# Altium project Weather_Station_ETH.PRJPCB (part 1 of 2)
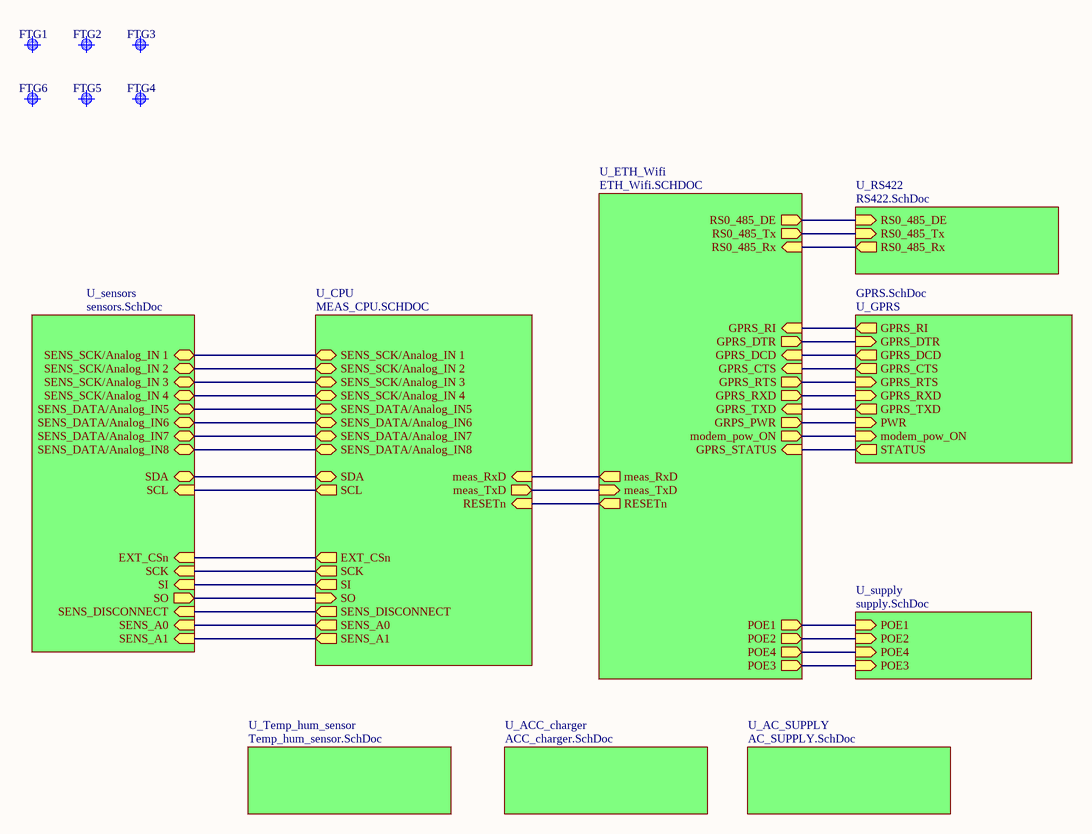
[diagram p0: Weather_Station_ETH.SCHDOC]
10 sheets, 510 parts. Net scope: hierarchical (ports join the sheet entries above them; power ports are global).
Board file: Weather_Station_ETH_HERMETIC.PcbDoc
Sheets:
  Weather_Station_ETH.SCHDOC
    U_ETH_Wifi = ETH_Wifi.SCHDOC
    U_sensors = sensors.SchDoc
    U_supply = supply.SchDoc
    U_CPU = MEAS_CPU.SchDoc
    U_AC_SUPPLY = AC_SUPPLY.SchDoc
    U_GPRS = GPRS.SchDoc
    U_RS422 = RS422.SchDoc
    U_Temp_hum_sensor = Temp_hum_sensor.SchDoc
    U_ACC_charger = ACC_charger.SchDoc

## Sheet Weather_Station_ETH.SCHDOC
size A4; SheetNumber: 0; SheetTotal: 0

### Parts
FTG1  Use only in PCB  [FIDUCIAL_TOP_S100-200]  (value not drawn)
FTG2  Use only in PCB  [FIDUCIAL_TOP_S100-200]  (value not drawn)
FTG3  Use only in PCB  [FIDUCIAL_TOP_S100-200]  (value not drawn)
FTG4  Use only in PCB  [FIDUCIAL_TOP_S100-200]  (value not drawn)
FTG5  Use only in PCB  [FIDUCIAL_TOP_S100-200]  (value not drawn)
FTG6  Use only in PCB  [FIDUCIAL_TOP_S100-200]  (value not drawn)

### Sub-sheets
U_AC_SUPPLY = AC_SUPPLY.SchDoc: no entries
U_ACC_charger = ACC_charger.SchDoc: no entries
U_CPU = MEAS_CPU.SCHDOC: EXT_CSn (out), SI (out), SO (in), SCK (out), SDA (bidir), SCL (out), SENS_A0 (out), SENS_A1 (out), SENS_SCK/Analog_IN 1 (bidir), SENS_SCK/Analog_IN 2 (bidir), SENS_SCK/Analog_IN 3 (bidir), SENS_SCK/Analog_IN 4 (bidir), SENS_DATA/Analog_IN5 (bidir), SENS_DATA/Analog_IN6 (bidir), SENS_DATA/Analog_IN7 (bidir), SENS_DATA/Analog_IN8 (bidir), meas_RxD (in), meas_TxD (out), RESETn (in), SENS_DISCONNECT (out)
U_ETH_Wifi = ETH_Wifi.SCHDOC: POE1 (out), POE2 (out), POE4 (out), POE3 (out), meas_RxD (out), meas_TxD (in), RESETn (out), GPRS_RI (in), GPRS_DTR (out), GPRS_DCD (in), GPRS_CTS (in), GPRS_RTS (out), GPRS_RXD (out), GPRS_TXD (in), GRPS_PWR (out), modem_pow_ON (out), GPRS_STATUS (in), RS0_485_DE (out), RS0_485_Tx (out), RS0_485_Rx (in)
U_GPRS = GPRS.SchDoc: GPRS_DCD (out), GPRS_TXD (out), GPRS_DTR (in), GPRS_RI (out), GPRS_RTS (in), GPRS_RXD (in), GPRS_CTS (out), STATUS (out), PWR (in), modem_pow_ON (in)
U_RS422 = RS422.SchDoc: RS0_485_DE (in), RS0_485_Rx (out), RS0_485_Tx (in)
U_sensors = sensors.SchDoc: SDA (bidir), SCL (in), EXT_CSn (in), SCK (in), SI (in), SO (out), SENS_A0 (in), SENS_A1 (in), SENS_DATA/Analog_IN8 (bidir), SENS_DATA/Analog_IN7 (bidir), SENS_DATA/Analog_IN6 (bidir), SENS_DATA/Analog_IN5 (bidir), SENS_SCK/Analog_IN 4 (bidir), SENS_SCK/Analog_IN 3 (bidir), SENS_SCK/Analog_IN 2 (bidir), SENS_SCK/Analog_IN 1 (bidir), SENS_DISCONNECT (in)
U_supply = supply.SchDoc: POE1 (in), POE2 (in), POE4 (in), POE3 (in)
U_Temp_hum_sensor = Temp_hum_sensor.SchDoc: no entries

### Nets
ADC0_in: sheet U_sensors/SENS_SCK/Analog_IN 1, sheet U_CPU/SENS_SCK/Analog_IN 1
ADC1_in: sheet U_sensors/SENS_SCK/Analog_IN 2, sheet U_CPU/SENS_SCK/Analog_IN 2
ADC2_in: sheet U_sensors/SENS_SCK/Analog_IN 3, sheet U_CPU/SENS_SCK/Analog_IN 3
ADC3_in: sheet U_sensors/SENS_SCK/Analog_IN 4, sheet U_CPU/SENS_SCK/Analog_IN 4
ADC5_in: sheet U_sensors/SENS_DATA/Analog_IN6, sheet U_CPU/SENS_DATA/Analog_IN6
ADC6_in: sheet U_sensors/SENS_DATA/Analog_IN7, sheet U_CPU/SENS_DATA/Analog_IN7
ADC7_in: sheet U_sensors/SENS_DATA/Analog_IN8, sheet U_CPU/SENS_DATA/Analog_IN8
BOOT_SEL: sheet U_sensors/SENS_DISCONNECT, sheet U_CPU/SENS_DISCONNECT
CTS1: sheet U_ETH_Wifi/GPRS_CTS, sheet U_GPRS/GPRS_CTS
modem_pow_ON: sheet U_ETH_Wifi/modem_pow_ON, sheet U_GPRS/modem_pow_ON
RESETn: sheet U_ETH_Wifi/RESETn, sheet U_CPU/RESETn
RS0_485_DE: sheet U_ETH_Wifi/RS0_485_DE, sheet U_RS422/RS0_485_DE
RTS1: sheet U_ETH_Wifi/GPRS_RTS, sheet U_GPRS/GPRS_RTS
RXD2: sheet U_ETH_Wifi/meas_TxD, sheet U_CPU/meas_TxD
SPI_MISO: sheet U_sensors/SO, sheet U_CPU/SO
SPI_MOSI: sheet U_sensors/SI, sheet U_CPU/SI
SPI_SCK: sheet U_sensors/SCK, sheet U_CPU/SCK
STATUS: sheet U_ETH_Wifi/GPRS_STATUS, sheet U_GPRS/STATUS
SWDIO: sheet U_sensors/SENS_DATA/Analog_IN5, sheet U_CPU/SENS_DATA/Analog_IN5
TXD2: sheet U_ETH_Wifi/meas_RxD, sheet U_CPU/meas_RxD
NetIC1_47: sheet U_ETH_Wifi/GPRS_DTR, sheet U_GPRS/GPRS_DTR
NetIC1_48: sheet U_ETH_Wifi/GPRS_DCD, sheet U_GPRS/GPRS_DCD
NetIC1_49: sheet U_ETH_Wifi/GRPS_PWR, sheet U_GPRS/PWR
NetIC1_69: sheet U_ETH_Wifi/GPRS_RI, sheet U_GPRS/GPRS_RI
NetIC6_3: sheet U_sensors/SDA, sheet U_CPU/SDA
NetIC6_9: sheet U_sensors/SENS_A1, sheet U_CPU/SENS_A1
NetIC6_10: sheet U_sensors/SENS_A0, sheet U_CPU/SENS_A0
NetIC6_13: sheet U_sensors/SCL, sheet U_CPU/SCL
NetIC8_13: sheet U_sensors/EXT_CSn, sheet U_CPU/EXT_CSn
NetIC40_1: sheet U_ETH_Wifi/RS0_485_Tx, sheet U_RS422/RS0_485_Tx
NetIC40_2: sheet U_ETH_Wifi/GPRS_RXD, sheet U_GPRS/GPRS_RXD
NetIC40_3: sheet U_ETH_Wifi/RS0_485_Rx, sheet U_RS422/RS0_485_Rx
NetIC40_5: sheet U_ETH_Wifi/GPRS_TXD, sheet U_GPRS/GPRS_TXD
NetJ6_4: sheet U_ETH_Wifi/POE4, sheet U_supply/POE4
NetJ6_5: sheet U_ETH_Wifi/POE3, sheet U_supply/POE3
NetJ6_7: sheet U_ETH_Wifi/POE2, sheet U_supply/POE2
NetJ6_8: sheet U_ETH_Wifi/POE1, sheet U_supply/POE1

### Library data of the parts
FTG1-FTG6 = Fiducial: Fiducial Target; Part Number: FIDUCIAL_TARGET_S100-200; Part Description: Scare Fiducial Target, Top Layer, 1.0mm, Top Sloder 2.0mm, Keepout =2.0mm; Mounted: No; Table: Pads; Component Kind: Standard (No BOM); Component Type: Standard (No BOM); Pin Count: 1; Family: Fiducial; Socket: No; SMD: Yes; Status: None; ComponentHeight: 0mm; Author: CERN DEM JLC; CreateDate: 09.02.2010; LatestRevisionDate: 09.02.2010; PackageDescription: Scare Fiducial Target, Top Layer, 1.0mm, Top Sloder 2.0mm, Keepout =2.0mm

## Sheet ETH_Wifi.SCHDOC
size A3; SheetNumber: 0; SheetTotal: 0
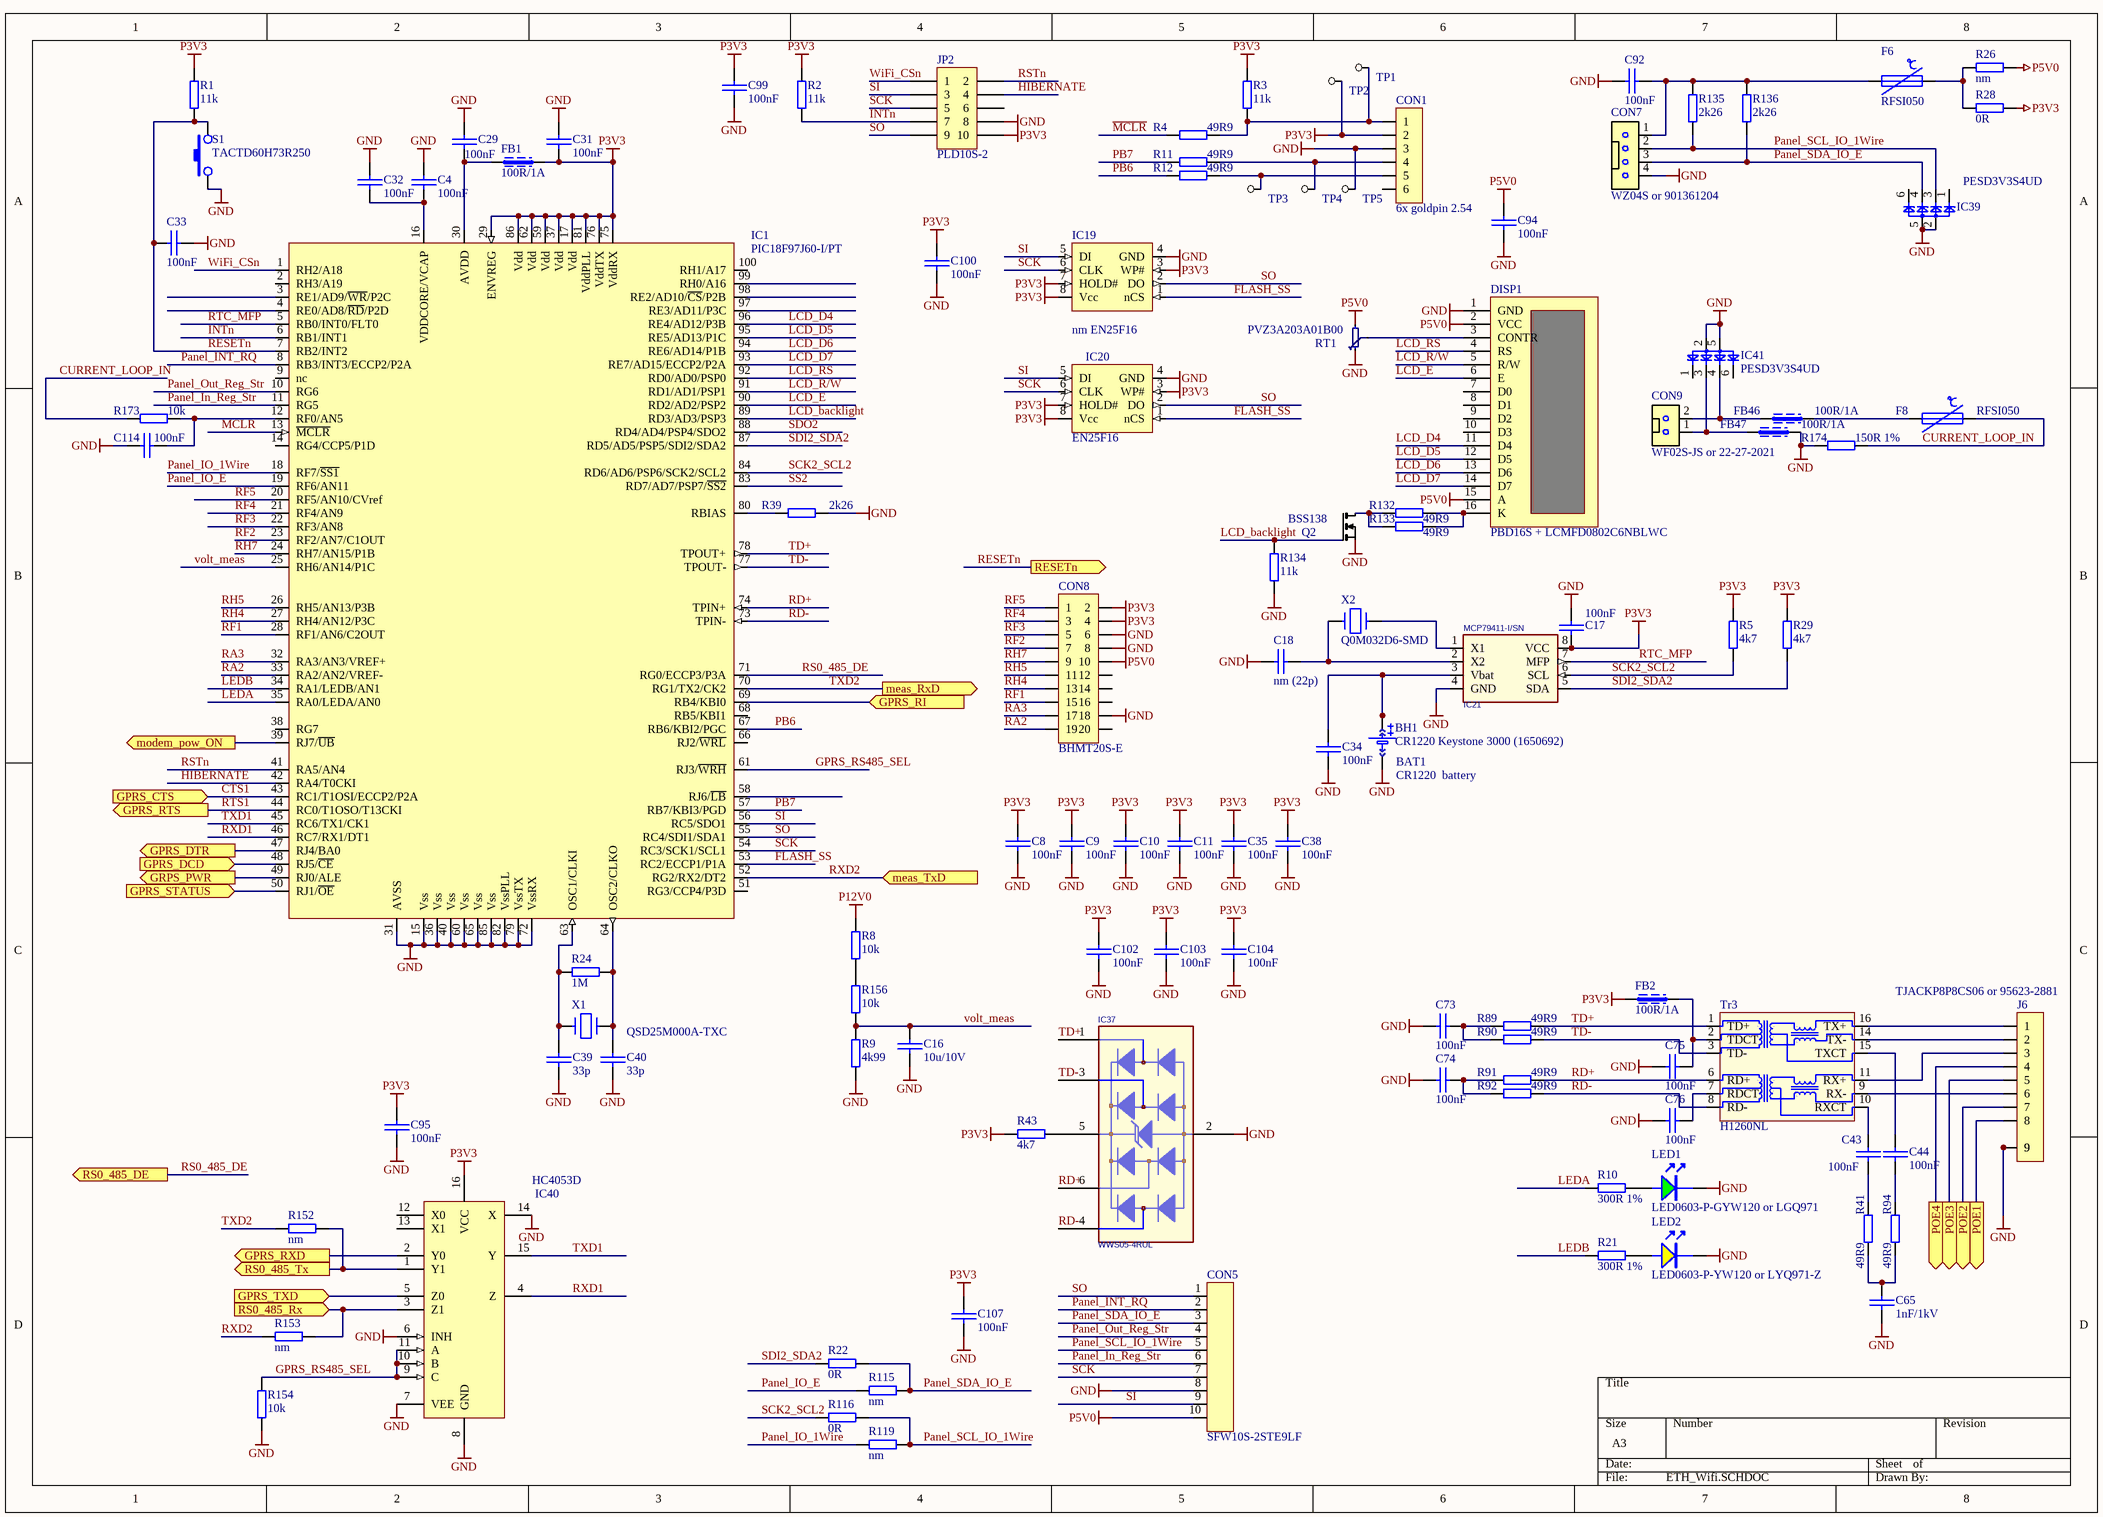
[diagram p1: ETH_Wifi.SCHDOC]

### Parts
BAT1  CR1220  battery  [cr1220]
BH1  CR1220 Keystone 3000 (1650692)  [CR1220_Keystone_3000]
C4  100nF  [0402C]
C8  100nF  [0402C]
C9  100nF  [0402C]
C10  100nF  [0402C]
C11  100nF  [0402C]
C16  10u/10V  [0805C]
C17  100nF  [0402C]
C18  nm (22p)  [0603C]
C29  100nF  [0402C]
C31  100nF  [0402C]
C32  100nF  [0402C]
C33  100nF  [0402C]
C34  100nF  [0402C]
C35  100nF  [0402C]
C38  100nF  [0402C]
C39  33p  [0603C]
C40  33p  [0603C]
C43  100nF  [0402C]
C44  100nF  [0402C]
C65  1nF/1kV  [1206C]
C73  100nF  [0402C]
C74  100nF  [0402C]
C75  100nF  [0402C]
C76  100nF  [0402C]
C92  100nF  [0402C]
C94  100nF  [0402C]
C95  100nF  [0402C]
C99  100nF  [0402C]
C100  100nF  [0402C]
C102  100nF  [0402C]
C103  100nF  [0402C]
C104  100nF  [0402C]
C107  100nF  [0402C]
C114  100nF  [0402C]
CON1  6x goldpin 2.54  [SIP6]
CON5  SFW10S-2STE9LF  [SFW10S-2STE9LF]
CON7  WZ04S or 901361204  [WZ04S]
CON8  BHMT20S-E  [BHMT20S]
CON9  WF02S-JS or 22-27-2021  [CON_WF02S-LF]
DISP1  PBD16S + LCMFD0802C6NBLWC  [LCMFD0802C6NBLWC]
F6  RFSI050  [0805R]
F8  RFSI050  [0805R]
FB1  100R/1A  [0603L]
FB2  100R/1A  [0603L]
FB46  100R/1A  [0603L]
FB47  100R/1A  [0603L]
IC1  PIC18F97J60-I/PT  [lqfp100_12x12mm]
IC19  nm EN25F16  [SO-8L]
IC20  EN25F16  [SO-8]
IC21  MCP79411-I/SN  [SO-8]
IC37  WWS05-4RUL  [SOT23-6]
IC39  PESD3V3S4UD  [SOT457]
IC40  HC4053D  [SO-16]
IC41  PESD3V3S4UD  [SOT457]
J6  TJACKP8P8CS06 or 95623-2881  [ETH_VERT_95623-2881]
JP2  PLD10S-2  [HEADER5X2]
LED1  LED0603-P-GYW120 or LGQ971  [led_0603G]
LED2  LED0603-P-YW120 or LYQ971-Z  [led_0603B]
Q2  BSS138  [SOT-23]
R1  11k  [0603R]
R2  11k  [0603R]
R3  11k  [0603R]
R4  49R9  [0603R]
R5  4k7  [0402R]
R8  10k  [0402R]
R9  4k99  [0603R]
R10  300R 1%  [0603R]
R11  49R9  [0603R]
R12  49R9  [0603R]
R21  300R 1%  [0603R]
R22  0R  [0603R]
R24  1M  [0603R]
R26  nm  [0603R]
R28  0R  [0603R]
R29  4k7  [0402R]
R39  2k26  [0603R]
R41  49R9  [0603]
R43  4k7  [0402R]
R89  49R9  [0603R]
R90  49R9  [0603R]
R91  49R9  [0603R]
R92  49R9  [0603R]
R94  49R9  [0603]
R115  nm  [0603R]
R116  0R  [0603R]
R119  nm  [0603R]
R132  49R9  [0603R]
R133  49R9  [0603R]
R134  11k  [0603R]
R135  2k26  [0603R]
R136  2k26  [0603R]
R152  nm  [0603R]
R153  nm  [0603R]
R154  10k  [0402R]
R156  10k  [0402R]
R173  10k  [0402R]
R174  150R 1%  [0805R]
RT1  PVZ3A203A01B00  [TRIMPOT_PVZ3A]
S1  TACTD60H73R250  [TACT-DQ62H73G160]
TP1  TP_nMCLR  [TP_large]  (value not drawn)
TP2  TP_3V3_ctrl  [TP_large]  (value not drawn)
TP3  TP_PB6  [TP_large]  (value not drawn)
TP4  TP_PB7  [TP_large]  (value not drawn)
TP5  TP_GND_ctrl  [TP_large]  (value not drawn)
Tr3  H1260NL  [H1260NL]
X1  QSD25M000A-TXC  [HC-49SM]
X2  Q0M032D6-SMD  [crystal_85SMX]

### Ports
GPRS_CTS (in), GPRS_DCD (in), GPRS_DTR (out), GPRS_RI (in), GPRS_RTS (out), GPRS_RXD (out), GPRS_STATUS (in), GPRS_TXD (in), GRPS_PWR (out), meas_RxD (out), meas_TxD (in), modem_pow_ON (out), POE1 (out), POE2 (out), POE3 (out), POE4 (out), RESETn (out), RS0_485_DE (out), RS0_485_Rx (in), RS0_485_Tx (out)

### Nets
GND: BH1.neg(+) C4.1 C8.1 C9.2 C10.2 C11.2 C16.2 C17.2 C18.2 C29.1 C31.1 C32.1 C33.2 C34.2 C35.2 C38.2 C39.1 C40.1 C65.2 C73.1 C74.1 C75.1 C76.1 C92.1 C94.1 C95.2 C99.2 C100.2 C102.2 C103.2 C104.2 C107.2 C114.1 CON1.3 CON5.8 CON7.4 CON8.6 CON8.8 CON8.18 DISP1.1(GND) FB47.2 IC1.15(Vss) IC1.31(AVSS) IC1.36(Vss) IC1.40(Vss) IC1.60(Vss) IC1.65(Vss) IC1.72(VssRX) IC1.79(VssTX) IC1.82(VssPLL) IC1.85(Vss) IC19.4(GND) IC20.4(GND) IC21.4(GND) IC37.2 IC39.2 IC39.5 IC40.6(INH) IC40.7(VEE) IC40.8(GND) IC40.14(X) IC41.2 IC41.5 J6.9a(9) J6.9b(9) JP2.8 LED1.K LED2.K Q2.2(S) R9.1 R39.2 R134.1 R154.1 R174.1 RT1.3 S1.1 TP5.1
P3V3: C8.2 C9.1 C10.1 C11.1 C17.1 C31.2 C35.1 C38.1 C95.1 C99.1 C100.1 C102.1 C103.1 C104.1 C107.1 CON1.2 CON8.2 CON8.4 FB1.2 FB2.1 IC1.17(Vdd) IC1.29(ENVREG) IC1.37(Vdd) IC1.59(Vdd) IC1.62(Vdd) IC1.75(VddRX) IC1.76(VddTX) IC1.81(VddPLL) IC1.86(Vdd) IC19.3(WP#) IC19.7(HOLD#) IC19.8(Vcc) IC20.3(WP#) IC20.7(HOLD#) IC20.8(Vcc) IC21.8(VCC) IC40.16(VCC) JP2.10 R1.2 R2.2 R3.2 R5.1 R28.2 R29.1 R43.1 TP2.1
P5V0: C94.2 CON5.10 CON8.10 DISP1.2(VCC) DISP1.15(A) R26.2 RT1.1
P12V0: R8.2
CTS1: IC1.43(RC1/T1OSI/ECCP2/P2A) ; port GPRS_CTS
CURRENT_LOOP_IN: F8.2 R173.1 R174.2
FLASH_SS: IC1.53(RC2/ECCP1/P1A) IC19.1(nCS) IC20.1(nCS)
GPRS_RS485_SEL: IC1.61(RJ3/~{WRH}) IC40.9(C) IC40.10(B) IC40.11(A) R154.2
HIBERNATE: IC1.42(RA4/T0CKI) JP2.4
INTn: IC1.6(RB1/INT1) JP2.7 R2.1
LCD_backlight: IC1.89(RD3/AD3/PSP3) Q2.1(G) R134.2
LCD_D4: DISP1.11(D4) IC1.96(RE4/AD12/P3B)
LCD_D5: DISP1.12(D5) IC1.95(RE5/AD13/P1C)
LCD_D6: DISP1.13(D6) IC1.94(RE6/AD14/P1B)
LCD_D7: DISP1.14(D7) IC1.93(RE7/AD15/ECCP2/P2A)
LCD_E: DISP1.6(E) IC1.90(RD2/AD2/PSP2)
LCD_R/W: DISP1.5(R/W) IC1.91(RD1/AD1/PSP1)
LCD_RS: DISP1.4(RS) IC1.92(RD0/AD0/PSP0)
LEDA: IC1.35(RA0/LEDA/AN0) R10.2
LEDB: IC1.34(RA1/LEDB/AN1) R21.2
~{MCLR}: IC1.13(~{MCLR}) R4.1
modem_pow_ON: IC1.39(RJ7/~{UB}) ; port modem_pow_ON
Panel_In_Reg_Str: CON5.6 IC1.11(RG5)
Panel_INT_RQ: CON5.2 IC1.8(RB3/INT3/ECCP2/P2A)
Panel_IO_1Wire: IC1.18(RF7/~{SS1}) R119.2
Panel_IO_E: IC1.19(RF6/AN11) R115.2
Panel_Out_Reg_Str: CON5.4 IC1.10(RG6)
Panel_SCL_IO_1Wire: CON5.5 CON7.2 IC39.3 R116.1 R119.1 R135.2
Panel_SDA_IO_E: CON5.3 CON7.3 IC39.4 R22.1 R115.1 R136.2
PB6: IC1.67(RB6/KBI2/PGC) R12.1
PB7: IC1.57(RB7/KBI3/PGD) R11.1
RA2: CON8.19 IC1.33(RA2/AN2/VREF-)
RA3: CON8.17 IC1.32(RA3/AN3/VREF+)
RD+: IC1.74(TPIN+) IC37.6 R91.2 Tr3.6(RD+)
RD-: IC1.73(TPIN-) IC37.4 R92.2 Tr3.8(RD-)
RESETn: C33.1 IC1.7(RB2/INT2) R1.1 S1.2 ; port RESETn
RF1: CON8.15 IC1.28(RF1/AN6/C2OUT)
RF2: CON8.7 IC1.23(RF2/AN7/C1OUT)
RF3: CON8.5 IC1.22(RF3/AN8)
RF4: CON8.3 IC1.21(RF4/AN9)
RF5: CON8.1 IC1.20(RF5/AN10/CVref)
RH4: CON8.13 IC1.27(RH4/AN12/P3C)
RH5: CON8.11 IC1.26(RH5/AN13/P3B)
RH7: CON8.9 IC1.24(RH7/AN15/P1B)
RS0_485_DE: IC1.71(RG0/ECCP3/P3A) ; port RS0_485_DE
RSTn: IC1.41(RA5/AN4) JP2.2
RTC_MFP: IC1.5(RB0/INT0/FLT0) IC21.7(MFP)
RTS1: IC1.44(RC0/T1OSO/T13CKI) ; port GPRS_RTS
RXD1: IC1.46(RC7/RX1/DT1) IC40.4(Z)
RXD2: IC1.52(RG2/RX2/DT2) R153.2 ; port meas_TxD
SCK: CON5.7 IC1.54(RC3/SCK1/SCL1) IC19.6(CLK) IC20.6(CLK) JP2.5
SCK2_SCL2: IC1.84(RD6/AD6/PSP6/SCK2/SCL2) IC21.6(SCL) R5.2 R116.2
SDI2_SDA2: IC1.87(RD5/AD5/PSP5/SDI2/SDA2) IC21.5(SDA) R22.2 R29.2
SDO2: IC1.88(RD4/AD4/PSP4/SDO2)
SI: CON5.9 IC1.56(RC5/SDO1) IC19.5(DI) IC20.5(DI) JP2.3
SO: CON5.1 IC1.55(RC4/SDI1/SDA1) IC19.2(DO) IC20.2(DO) JP2.9
SS2: IC1.83(RD7/AD7/PSP7/~{SS2})
STATUS: IC1.50(RJ1/~{OE}) ; port GPRS_STATUS
TD+: IC1.78(TPOUT+) IC37.1 R89.2 Tr3.1(TD+)
TD-: IC1.77(TPOUT-) IC37.3 R90.2 Tr3.3(TD-)
TXD1: IC1.45(RC6/TX1/CK1) IC40.15(Y)
TXD2: IC1.70(RG1/TX2/CK2) R152.2 ; port meas_RxD
volt_meas: C16.1 IC1.25(RH6/AN14/P1C) R9.2 R156.1
WiFi_CSn: IC1.1(RH2/A18) JP2.1
NetBH1_pos1: BH1.pos1(+) BH1.pos2(+) C34.1 IC21.3(Vbat)
NetC4_2: C4.2 C32.2 IC1.16(VDDCORE/VCAP)
NetC18_1: C18.1 IC21.2(X2) X2.4
NetC29_2: C29.2 FB1.1 IC1.30(AVDD)
NetC39_2: C39.2 IC1.63(OSC1/CLKI) R24.1 X1.1
NetC40_2: C40.2 IC1.64(OSC2/CLKO) R24.2 X1.2
NetC43_1: C43.1 R41.2
NetC43_2: C43.2 Tr3.10(RXCT)
NetC44_1: C44.1 R94.2
NetC44_2: C44.2 Tr3.15(TXCT)
NetC65_1: C65.1 R41.1 R94.1
NetC73_2: C73.2 R89.1 R90.1
NetC74_2: C74.2 R91.1 R92.1
NetC75_2: C75.2 FB2.2 Tr3.2(TDCT)
NetC76_2: C76.2 Tr3.7(RDCT)
NetC92_2: C92.2 CON7.1 F6.1 R135.1 R136.1
NetC114_2: C114.2 IC1.12(RF0/AN5) R173.2
NetCON1_1: CON1.1 R3.1 R4.2 TP1.1
NetCON1_4: CON1.4 R11.2 TP4.1
NetCON1_5: CON1.5 R12.2 TP3.1
NetCON9_1: CON9.1 FB47.1 IC41.3
NetCON9_2: CON9.2 FB46.1 IC41.4
NetDISP1_3: DISP1.3(CONTR) RT1.2
NetDISP1_16: DISP1.16(K) R132.2 R133.2
NetF6_2: F6.2 R26.1 R28.1
NetF8_1: F8.1 FB46.2
NetIC1_47: IC1.47(RJ4/BA0) ; port GPRS_DTR
NetIC1_48: IC1.48(RJ5/~{CE}) ; port GPRS_DCD
NetIC1_49: IC1.49(RJ0/ALE) ; port GRPS_PWR
NetIC1_69: IC1.69(RB4/KBI0) ; port GPRS_RI
NetIC1_80: IC1.80(RBIAS) R39.1
NetIC21_1: IC21.1(X1) X2.1
NetIC37_5: IC37.5 R43.2
NetIC40_1: IC40.1(Y1) R152.1 ; port RS0_485_Tx
NetIC40_2: IC40.2(Y0) ; port GPRS_RXD
NetIC40_3: IC40.3(Z1) R153.1 ; port RS0_485_Rx
NetIC40_5: IC40.5(Z0) ; port GPRS_TXD
NetJ6_1: J6.1 Tr3.16(TX+)
NetJ6_2: J6.2 Tr3.14(TX-)
NetJ6_3: J6.3 Tr3.11(RX+)
NetJ6_4: J6.4 ; port POE4
NetJ6_5: J6.5 ; port POE3
NetJ6_6: J6.6 Tr3.9(RX-)
NetJ6_7: J6.7 ; port POE2
NetJ6_8: J6.8 ; port POE1
NetLED1_A: LED1.A R10.1
NetLED2_A: LED2.A R21.1
NetQ2_3: Q2.3(D) R132.1 R133.1
NetR8_1: R8.1 R156.2

Not connected (* = marked no-connect by the designer): CON1 6; CON8 12 14 16 20; DISP1 7(D0) 8(D1) 9(D2) 10(D3); IC1 2(RH3/A19) 3(RE1/AD9/~{WR}/P2C) 4(RE0/AD8/~{RD}/P2D) 9(nc) 14(RG4/CCP5/P1D) 38(RG7) 51(RG3/CCP4/P3D) 58(RJ6/~{LB}) 66(RJ2/~{WRL}) 68(RB5/KBI1) 97(RE3/AD11/P3C) 98(RE2/AD10/~{CS}/P2B) 99(RH0/A16) 100(RH1/A17); IC39 1 6; IC40 12(X0) 13(X1); IC41 1 6; JP2 6

### Library data of the parts
BAT1 = BATTERY_CR1220: CR-21220 Battery 3V 35mAh; Supplier 1: Farnell; Supplier Part Number 1: 1892664
BH1 = BATTERY_HOLD_CR1220: CR-1220 Battery holder; Supplier 1: Newark; Supplier Part Number 1: 66F5622
C4 C8-C11 C17 C29 C31-C35 C38 C43 C44 C73-C76 C92 C94 C95 C99 C100 C102-C104 C107 C114 = CAP_SMD_0402: Capacitor SMD; Supplier 1: Newark; Supplier Part Number 1: 14T3275
C16 = CAP_SMD_0805: Capacitor SMD; Supplier 1: Farnell; Supplier Part Number 1: 1833812
C18 = CAP_SMD_0603: Capacitor SMD
C39 C40 = CAP_SMD: Capacitor SMD
C65 = CAP_SMD_1206: Capacitor SMD; Supplier 1: Newark; Supplier Part Number 1: 90R7810
CON1 = CON6
CON5 = CON_ZIF_10_1mm_SMT_V: FCI ZIF 1mm connector (Farnell)
CON7 = CON_4_2.54_key: 2.54mm crimped terminal header
CON8 = CON_IDC20_SMT_2mm: 20 pin, IDC receptacle, 2mm
CON9 = CON_2_2.54_key: 2.54mm crimped terminal header
DISP1 = LCD_HD44780_LED_2x8: LCD character display socket with backlight
F6 F8 = F_PTC_0.05A: 50mA polymer FUSE
FB1 FB2 FB46 FB47 = L_FERRITE_BEAD: ferrite bead
IC1 = UPC_PIC18F96J65_PT
IC19 IC20 = MEM_EN25F16: FLASH (maritex)
IC21 = RTC_MCP79411: RTC with 1k EEPROM, RAM and 48bit unique ID; Supplier 1: Newark; Supplier Part Number 1: 76R6660
IC37 = D_TVS_WWS05-4RUL: TVS, 5V; Specification: SMD,ESD COMPONENT,ROHS
IC39 IC41 = D_TVS_PESD3V3S4UD: 3.3V TVS
IC40 = 4053
J6 = CON_MOD_8pin_V: Modular 8pin (Maritex or Molex)
JP2 = CON_HEADER 5X2: Goldpin 2.54mm
LED1 = LED_0603G: LED 0603 green; Supplier 1: Newark; Supplier Part Number 1: 05M0493
LED2 = LED_0603Y: LED 0603 yellow; Supplier 1: Newark; Supplier Part Number 1: 56P5112
Q2 = Q_BSS138
R1-R4 R10-R12 R21 R24 R39 R41 R89-R92 R94 R134 = RES_SMD: SMD Resistor
R5 R8 R29 R43 R154 R156 R173 = RES_0402: SMD Resistor; Supplier 1: Newark; Supplier Part Number 1: 59M6691
R9 R22 R26 R28 R115 R116 R119 R132 R133 R135 R136 R152 R153 = RES_0603: SMD Resistor
  R26 R28 R132 R133 R135 R136: Supplier 1: Newark; Supplier Part Number 1: 39K0073
R174 = RES_0805: SMD Resistor; Supplier 1: Newark; Supplier Part Number 1: 05F1507
RT1 = TRIMPOT_SMD_CARBON: carbon SMD trimpot (Farnell)
S1 = SW-PB: Push button 7.3mm
TP1-TP5 = TP: Testpoint
Tr3 = TR_H1260NL: ethernet trafo (TME)
X1 = CRYSTAL: Crystal oscillator
X2 = X_CRYSTAL_32k_SMD: Crystal oscillator 32k (Maritex); Supplier 1: Farnell; Supplier Part Number 1: 1832136

## Sheet sensors.SchDoc
size A4
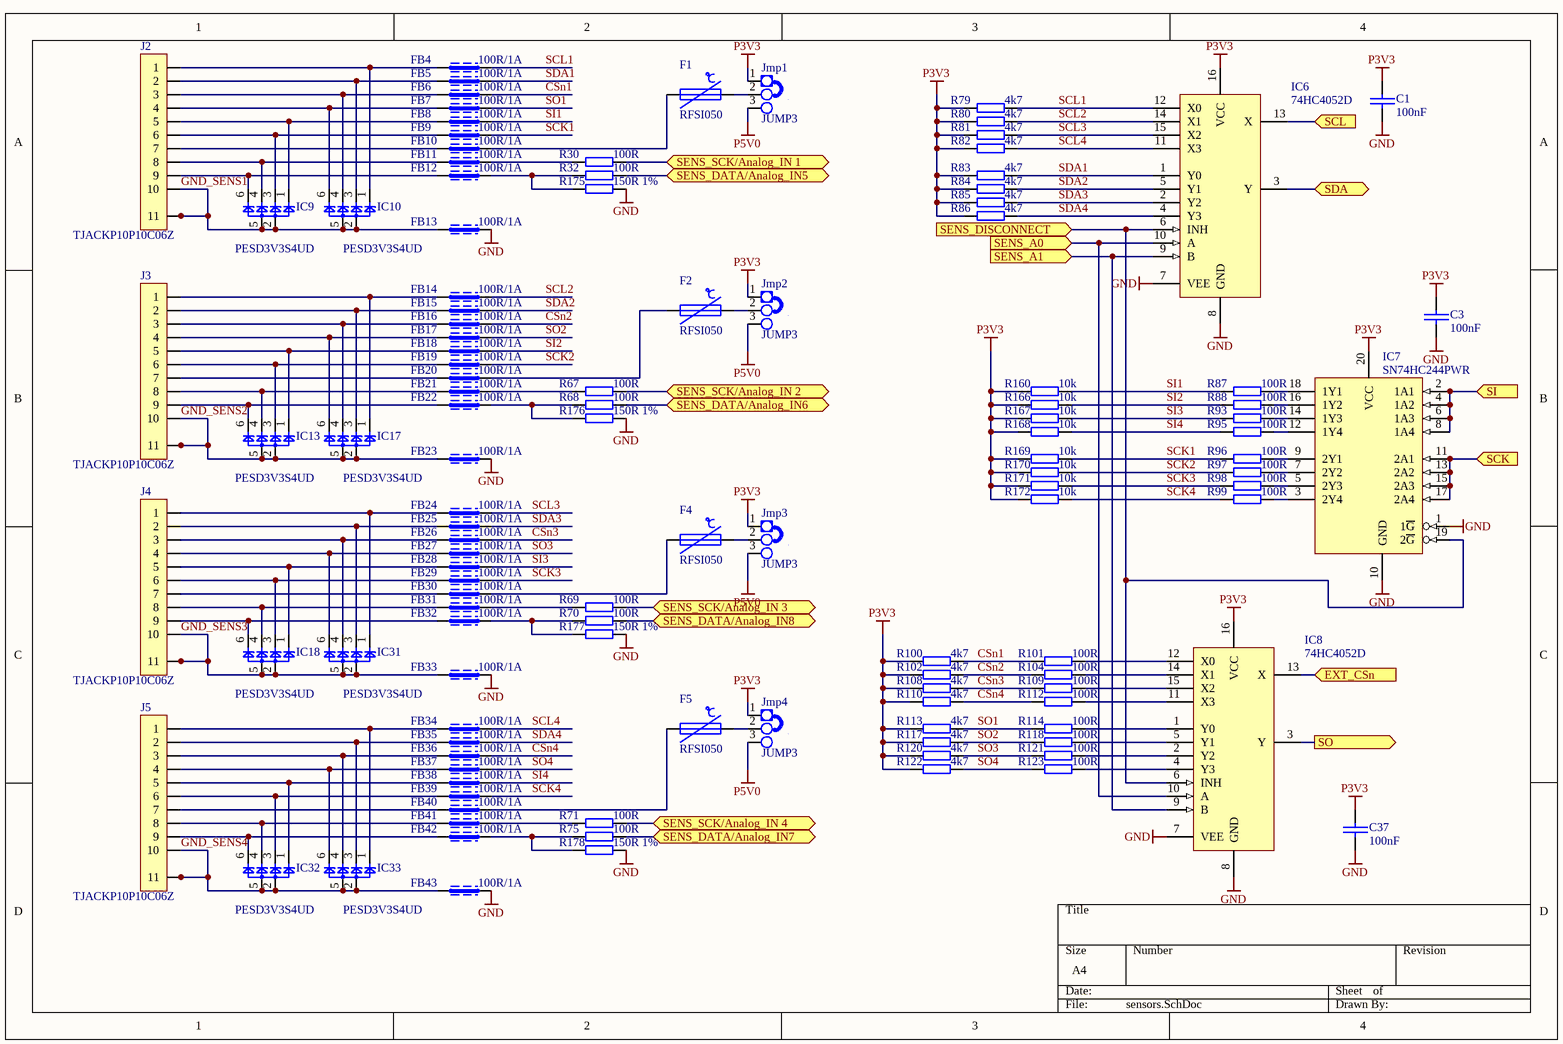
[diagram p2: sensors.SchDoc]

### Parts
C1  100nF  [0402C]
C3  100nF  [0402C]
C37  100nF  [0402C]
F1  RFSI050  [0805R]
F2  RFSI050  [0805R]
F4  RFSI050  [0805R]
F5  RFSI050  [0805R]
FB4  100R/1A  [0603L]
FB5  100R/1A  [0603L]
FB6  100R/1A  [0603L]
FB7  100R/1A  [0603L]
FB8  100R/1A  [0603L]
FB9  100R/1A  [0603L]
FB10  100R/1A  [0603L]
FB11  100R/1A  [0603L]
FB12  100R/1A  [0603L]
FB13  100R/1A  [0603L]
FB14  100R/1A  [0603L]
FB15  100R/1A  [0603L]
FB16  100R/1A  [0603L]
FB17  100R/1A  [0603L]
FB18  100R/1A  [0603L]
FB19  100R/1A  [0603L]
FB20  100R/1A  [0603L]
FB21  100R/1A  [0603L]
FB22  100R/1A  [0603L]
FB23  100R/1A  [0603L]
FB24  100R/1A  [0603L]
FB25  100R/1A  [0603L]
FB26  100R/1A  [0603L]
FB27  100R/1A  [0603L]
FB28  100R/1A  [0603L]
FB29  100R/1A  [0603L]
FB30  100R/1A  [0603L]
FB31  100R/1A  [0603L]
FB32  100R/1A  [0603L]
FB33  100R/1A  [0603L]
FB34  100R/1A  [0603L]
FB35  100R/1A  [0603L]
FB36  100R/1A  [0603L]
FB37  100R/1A  [0603L]
FB38  100R/1A  [0603L]
FB39  100R/1A  [0603L]
FB40  100R/1A  [0603L]
FB41  100R/1A  [0603L]
FB42  100R/1A  [0603L]
FB43  100R/1A  [0603L]
IC6  74HC4052D  [SO-16]
IC7  SN74HC244PWR  [tssop20]
IC8  74HC4052D  [SO-16]
IC9  PESD3V3S4UD  [SOT457]
IC10  PESD3V3S4UD  [SOT457]
IC13  PESD3V3S4UD  [SOT457]
IC17  PESD3V3S4UD  [SOT457]
IC18  PESD3V3S4UD  [SOT457]
IC31  PESD3V3S4UD  [SOT457]
IC32  PESD3V3S4UD  [SOT457]
IC33  PESD3V3S4UD  [SOT457]
J2  TJACKP10P10C06Z  [TJACKP10P10C06Z]
J3  TJACKP10P10C06Z  [TJACKP10P10C06Z]
J4  TJACKP10P10C06Z  [TJACKP10P10C06Z]
J5  TJACKP10P10C06Z  [TJACKP10P10C06Z]
Jmp1  JUMP3  [jump3]
Jmp2  JUMP3  [jump3]
Jmp3  JUMP3  [jump3]
Jmp4  JUMP3  [jump3]
R30  100R  [0402R]
R32  100R  [0402R]
R67  100R  [0402R]
R68  100R  [0402R]
R69  100R  [0402R]
R70  100R  [0402R]
R71  100R  [0402R]
R75  100R  [0402R]
R79  4k7  [0402R]
R80  4k7  [0402R]
R81  4k7  [0402R]
R82  4k7  [0402R]
R83  4k7  [0402R]
R84  4k7  [0402R]
R85  4k7  [0402R]
R86  4k7  [0402R]
R87  100R  [0402R]
R88  100R  [0402R]
R93  100R  [0402R]
R95  100R  [0402R]
R96  100R  [0402R]
R97  100R  [0402R]
R98  100R  [0402R]
R99  100R  [0402R]
R100  4k7  [0402R]
R101  100R  [0402R]
R102  4k7  [0402R]
R104  100R  [0402R]
R108  4k7  [0402R]
R109  100R  [0402R]
R110  4k7  [0402R]
R112  100R  [0402R]
R113  4k7  [0402R]
R114  100R  [0402R]
R117  4k7  [0402R]
R118  100R  [0402R]
R120  4k7  [0402R]
R121  100R  [0402R]
R122  4k7  [0402R]
R123  100R  [0402R]
R160  10k  [0402R]
R166  10k  [0402R]
R167  10k  [0402R]
R168  10k  [0402R]
R169  10k  [0402R]
R170  10k  [0402R]
R171  10k  [0402R]
R172  10k  [0402R]
R175  150R 1%  [0805R]
R176  150R 1%  [0805R]
R177  150R 1%  [0805R]
R178  150R 1%  [0805R]

### Ports
EXT_CSn (in), SCK (in), SCL (in), SDA (bidir), SENS_A0 (in), SENS_A1 (in), SENS_DATA/Analog_IN5 (bidir), SENS_DATA/Analog_IN6 (bidir), SENS_DATA/Analog_IN7 (bidir), SENS_DATA/Analog_IN8 (bidir), SENS_DISCONNECT (in), SENS_SCK/Analog_IN 1 (bidir), SENS_SCK/Analog_IN 2 (bidir), SENS_SCK/Analog_IN 3 (bidir), SENS_SCK/Analog_IN 4 (bidir), SI (in), SO (out)

### Nets
GND: C1.2 C3.2 C37.2 FB13.2 FB23.2 FB33.2 FB43.2 IC6.7(VEE) IC6.8(GND) IC7.1(1~{G}) IC7.10(GND) IC8.7(VEE) IC8.8(GND) R175.2 R176.2 R177.2 R178.2
P3V3: C1.1 C3.1 C37.1 IC6.16(VCC) IC7.20(VCC) IC8.16(VCC) Jmp1.1 Jmp2.1 Jmp3.1 Jmp4.1 R79.1 R80.1 R81.1 R82.1 R83.1 R84.1 R85.1 R86.1 R100.1 R102.1 R108.1 R110.1 R113.1 R117.1 R120.1 R122.1 R160.1 R166.1 R167.1 R168.1 R169.1 R170.1 R171.1 R172.1
P5V0: Jmp1.3 Jmp2.3 Jmp3.3 Jmp4.3
ADC0_in: R30.2 ; port SENS_SCK/Analog_IN 1
ADC1_in: R67.2 ; port SENS_SCK/Analog_IN 2
ADC2_in: R69.2 ; port SENS_SCK/Analog_IN 3
ADC3_in: R71.2 ; port SENS_SCK/Analog_IN 4
ADC5_in: R68.2 ; port SENS_DATA/Analog_IN6
ADC6_in: R75.2 ; port SENS_DATA/Analog_IN7
ADC7_in: R70.2 ; port SENS_DATA/Analog_IN8
BOOT_SEL: IC6.6(INH) IC7.19(2~{G}) IC8.6(INH) ; port SENS_DISCONNECT
CSn1: FB6.2 R100.2 R101.1
CSn2: FB16.2 R102.2 R104.1
CSn3: FB26.2 R108.2 R109.1
CSn4: FB36.2 R110.2 R112.1
GND_SENS1: FB13.1 IC9.2 IC9.5 IC10.2 IC10.5 J2.10 J2.11 J2.11a J2.12 J2.12a
GND_SENS2: FB23.1 IC13.2 IC13.5 IC17.2 IC17.5 J3.10 J3.11 J3.11a J3.12 J3.12a
GND_SENS3: FB33.1 IC18.2 IC18.5 IC31.2 IC31.5 J4.10 J4.11 J4.11a J4.12 J4.12a
GND_SENS4: FB43.1 IC32.2 IC32.5 IC33.2 IC33.5 J5.10 J5.11 J5.11a J5.12 J5.12a
SCK1: FB9.2 R96.1 R169.2
SCK2: FB19.2 R97.1 R170.2
SCK3: FB29.2 R98.1 R171.2
SCK4: FB39.2 R99.1 R172.2
SCL1: FB4.2 IC6.12(X0) R79.2
SCL2: FB14.2 IC6.14(X1) R80.2
SCL3: FB24.2 IC6.15(X2) R81.2
SCL4: FB34.2 IC6.11(X3) R82.2
SDA1: FB5.2 IC6.1(Y0) R83.2
SDA2: FB15.2 IC6.5(Y1) R84.2
SDA3: FB25.2 IC6.2(Y2) R85.2
SDA4: FB35.2 IC6.4(Y3) R86.2
SI1: FB8.2 R87.1 R160.2
SI2: FB18.2 R88.1 R166.2
SI3: FB28.2 R93.1 R167.2
SI4: FB38.2 R95.1 R168.2
SO1: FB7.2 R113.2 R114.1
SO2: FB17.2 R117.2 R118.1
SO3: FB27.2 R120.2 R121.1
SO4: FB37.2 R122.2 R123.1
SPI_MISO: IC8.3(Y) ; port SO
SPI_MOSI: IC7.2(1A1) IC7.4(1A2) IC7.6(1A3) IC7.8(1A4) ; port SI
SPI_SCK: IC7.11(2A1) IC7.13(2A2) IC7.15(2A3) IC7.17(2A4) ; port SCK
SWDIO: R32.2 ; port SENS_DATA/Analog_IN5
NetF1_1: F1.1 FB10.2
NetF1_2: F1.2 Jmp1.2
NetF2_1: F2.1 FB20.2
NetF2_2: F2.2 Jmp2.2
NetF4_1: F4.1 FB30.2
NetF4_2: F4.2 Jmp3.2
NetF5_1: F5.1 FB40.2
NetF5_2: F5.2 Jmp4.2
NetFB4_1: FB4.1 IC10.1 J2.1
NetFB5_1: FB5.1 IC10.3 J2.2
NetFB6_1: FB6.1 IC10.4 J2.3
NetFB7_1: FB7.1 IC10.6 J2.4
NetFB8_1: FB8.1 IC9.1 J2.5
NetFB9_1: FB9.1 IC9.3 J2.6
NetFB10_1: FB10.1 J2.7
NetFB11_1: FB11.1 IC9.4 J2.8
NetFB11_2: FB11.2 R30.1
NetFB12_1: FB12.1 IC9.6 J2.9
NetFB12_2: FB12.2 R32.1 R175.1
NetFB14_1: FB14.1 IC17.1 J3.1
NetFB15_1: FB15.1 IC17.3 J3.2
NetFB16_1: FB16.1 IC17.4 J3.3
NetFB17_1: FB17.1 IC17.6 J3.4
NetFB18_1: FB18.1 IC13.1 J3.5
NetFB19_1: FB19.1 IC13.3 J3.6
NetFB20_1: FB20.1 J3.7
NetFB21_1: FB21.1 IC13.4 J3.8
NetFB21_2: FB21.2 R67.1
NetFB22_1: FB22.1 IC13.6 J3.9
NetFB22_2: FB22.2 R68.1 R176.1
NetFB24_1: FB24.1 IC31.1 J4.1
NetFB25_1: FB25.1 IC31.3 J4.2
NetFB26_1: FB26.1 IC31.4 J4.3
NetFB27_1: FB27.1 IC31.6 J4.4
NetFB28_1: FB28.1 IC18.1 J4.5
NetFB29_1: FB29.1 IC18.3 J4.6
NetFB30_1: FB30.1 J4.7
NetFB31_1: FB31.1 IC18.4 J4.8
NetFB31_2: FB31.2 R69.1
NetFB32_1: FB32.1 IC18.6 J4.9
NetFB32_2: FB32.2 R70.1 R177.1
NetFB34_1: FB34.1 IC33.1 J5.1
NetFB35_1: FB35.1 IC33.3 J5.2
NetFB36_1: FB36.1 IC33.4 J5.3
NetFB37_1: FB37.1 IC33.6 J5.4
NetFB38_1: FB38.1 IC32.1 J5.5
NetFB39_1: FB39.1 IC32.3 J5.6
NetFB40_1: FB40.1 J5.7
NetFB41_1: FB41.1 IC32.4 J5.8
NetFB41_2: FB41.2 R71.1
NetFB42_1: FB42.1 IC32.6 J5.9
NetFB42_2: FB42.2 R75.1 R178.1
NetIC6_3: IC6.3(Y) ; port SDA
NetIC6_9: IC6.9(B) IC8.9(B) ; port SENS_A1
NetIC6_10: IC6.10(A) IC8.10(A) ; port SENS_A0
NetIC6_13: IC6.13(X) ; port SCL
NetIC7_3: IC7.3(2Y4) R99.2
NetIC7_5: IC7.5(2Y3) R98.2
NetIC7_7: IC7.7(2Y2) R97.2
NetIC7_9: IC7.9(2Y1) R96.2
NetIC7_12: IC7.12(1Y4) R95.2
NetIC7_14: IC7.14(1Y3) R93.2
NetIC7_16: IC7.16(1Y2) R88.2
NetIC7_18: IC7.18(1Y1) R87.2
NetIC8_1: IC8.1(Y0) R114.2
NetIC8_2: IC8.2(Y2) R121.2
NetIC8_4: IC8.4(Y3) R123.2
NetIC8_5: IC8.5(Y1) R118.2
NetIC8_11: IC8.11(X3) R112.2
NetIC8_12: IC8.12(X0) R101.2
NetIC8_13: IC8.13(X) ; port EXT_CSn
NetIC8_14: IC8.14(X1) R104.2
NetIC8_15: IC8.15(X2) R109.2

### Library data of the parts
C1 C3 C37 = CAP_SMD_0402: Capacitor SMD; Supplier 1: Newark; Supplier Part Number 1: 14T3275
F1 F2 F4 F5 = F_PTC_0.05A: 50mA polymer FUSE
FB4-FB43 = L_FERRITE_BEAD_0603: ferrite bead 100R@100MHz 1A; Supplier 1: Newark; Supplier Part Number 1: 89R3144
IC6 IC8 = 4052
IC7 = 74HC244: TTL BUS tristate
IC9 IC10 IC13 IC17 IC18 IC31-IC33 = D_TVS_PESD3V3S4UD: 3.3V TVS
J2-J5 = CON_MOD_10pin_V: Modular 10pin (Maritex or Molex)
R30 R32 R67-R71 R75 R79-R88 R93 R95-R102 R104 R108-R110 R112-R114 R117 R118 R120-R123 R160 R166-R172 = RES_0402: SMD Resistor; Supplier 1: Newark; Supplier Part Number 1: 59M6691
R175-R178 = RES_0805: SMD Resistor; Supplier 1: Newark; Supplier Part Number 1: 05F1507

## Sheet supply.SchDoc
size A3
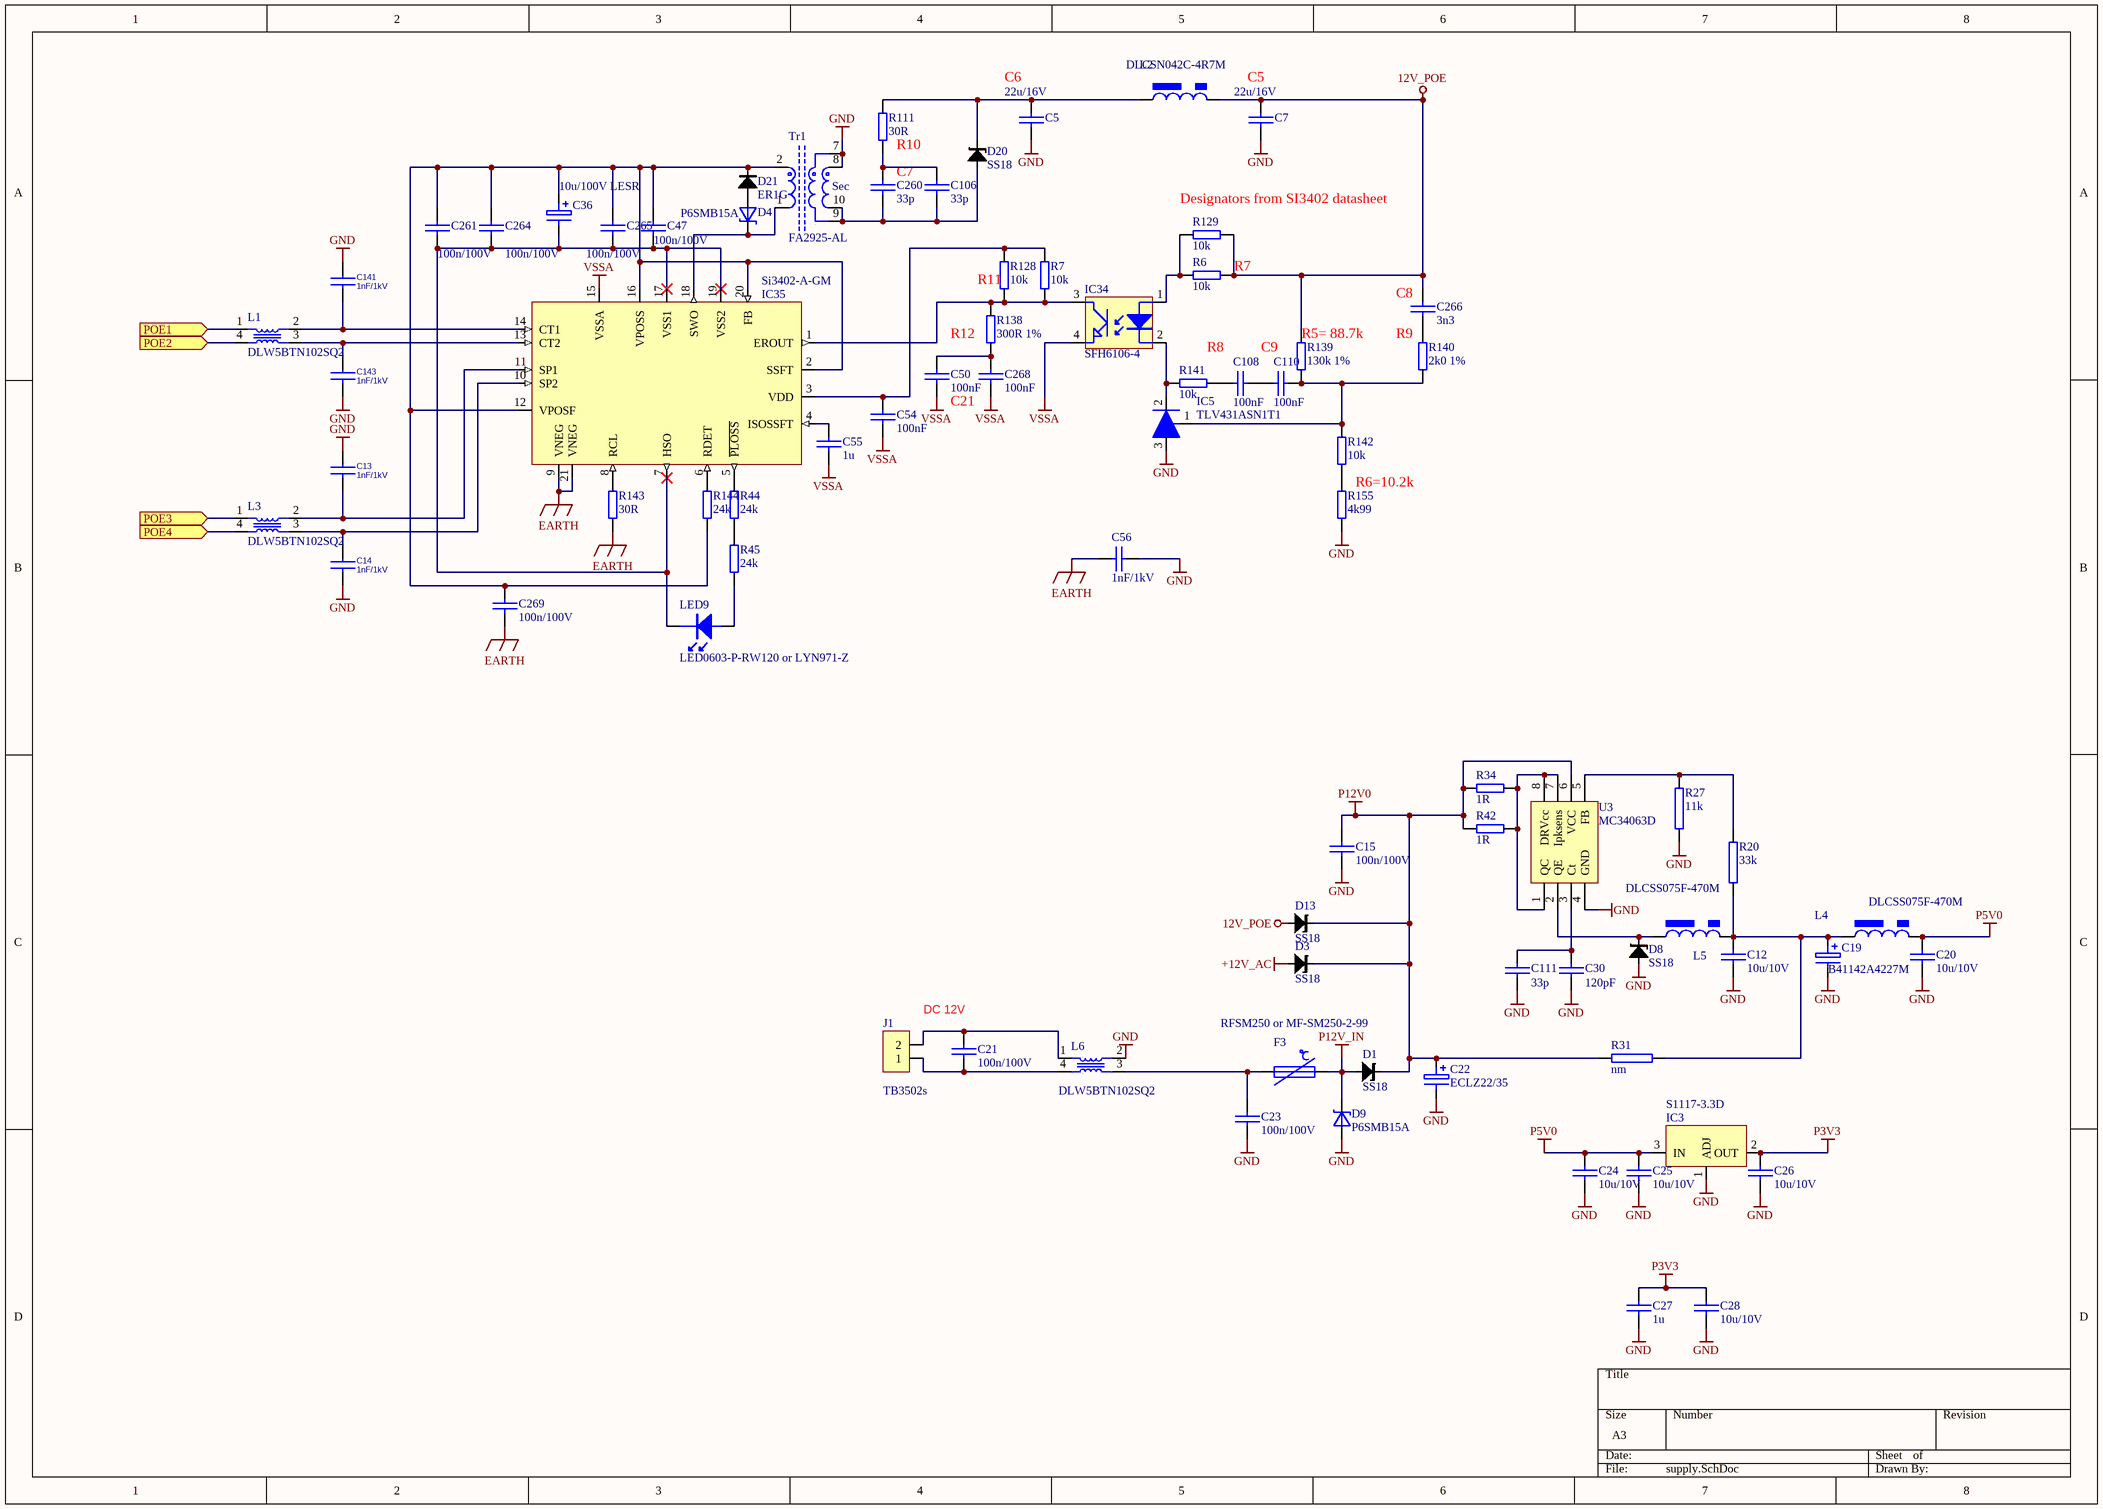
[diagram p3: supply.SchDoc]

### Parts
C5  22u/16V  [1206C]
C7  22u/16V  [1206C]
C12  10u/10V  [0805C]
C13  1nF/1kV  [1206C]
C14  1nF/1kV  [1206C]
C15  100n/100V  [0805C]
C19  B41142A4227M  [CAP_SMT_EL_5mm_C]
C20  10u/10V  [0805C]
C21  100n/100V  [0805C]
C22  ECLZ22/35  [CAP_SMT_EL_6.3mm_D]
C23  100n/100V  [0805C]
C24  10u/10V  [0805C]
C25  10u/10V  [0805C]
C26  10u/10V  [0805C]
C27  1u  [0603C]
C28  10u/10V  [0805C]
C30  120pF  [0603C]
C36  10u/100V LESR  [RB.1/.2]
C47  100n/100V  [0805C]
C50  100nF  [0402C]
C54  100nF  [0402C]
C55  1u  [0603C]
C56  1nF/1kV  [1206C]
C106  33p  [0603C]
C108  100nF  [0402C]
C110  100nF  [0402C]
C111  33p  [0603C]
C141  1nF/1kV  [1206C]
C143  1nF/1kV  [1206C]
C260  33p  [0603C]
C261  100n/100V  [0805C]
C264  100n/100V  [0805C]
C265  100n/100V  [0805C]
C266  3n3  [0603C]
C268  100nF  [0402C]
C269  100n/100V  [0805C]
D1  SS18  [DO-214AC/SMA]
D3  SS18  [DO-214AC/SMA]
D4  P6SMB15A  [DO-214AA/SMB]
D8  SS18  [DO-214AC/SMA]
D9  P6SMB15A  [DO-214AA/SMB]
D13  SS18  [DO-214AC/SMA]
D20  SS18  [DO-214AC/SMA]
D21  ER1G  [DO-214AA/SMB]
F3  RFSM250 or MF-SM250-2-99  [SMD150-2]
IC3  S1117-3.3D  [TO-252]
IC5  TLV431ASN1T1  [SOT-23]
IC34  SFH6106-4  [SOP_4]
IC35  Si3402-A-GM  [QFN20]
J1  TB3502s  [tbx3502s]
L1  DLW5BTN102SQ2  [DLW5BT]
L2  DLCSN042C-4R7M  [L_DLCSN042C]
L3  DLW5BTN102SQ2  [DLW5BT]
L4  DLCSS075F-470M  [choke_DLSD75]
L5  DLCSS075F-470M  [choke_DLSD75]
L6  DLW5BTN102SQ2  [DLW5BT]
LED9  LED0603-P-RW120 or LYN971-Z  [led_0603R]
R6  10k  [0402R]
R7  10k  [0402R]
R20  33k  [0603R]
R27  11k  [0603R]
R31  nm  [0603]
R34  1R  [0603R]
R42  1R  [0603R]
R44  24k  [0805R]
R45  24k  [0805R]
R111  30R  [0603R]
R128  10k  [0402R]
R129  10k  [0402R]
R138  300R 1%  [0603R]
R139  130k 1%  [0603R]
R140  2k0 1%  [0603R]
R141  10k  [0402R]
R142  10k  [0603R]
R143  30R  [0603R]
R144  24k  [0805R]
R155  4k99  [0603R]
Tr1  FA2925-AL  [Tr_FA2805]
U3  MC34063D  [so-8]

### Ports
POE1 (in), POE2 (in), POE3 (in), POE4 (in)

### Nets
12V_POE: C7.1 C266.2 D13.A L2.2 R6.1 R129.1 R139.2
+12V_AC: D3.A
EARTH: C56.1 C269.2 IC35.9(VNEG) IC35.21(VNEG) R143.1
GND: C5.2 C7.2 C12.2 C13.1 C14.2 C15.2 C19.2 C20.2 C22.2 C23.2 C24.2 C25.2 C26.2 C27.2 C28.2 C30.1 C56.2 C111.1 C141.1 C143.2 D8.A D9.A IC3.1(ADJ) IC5.3(A) L6.2 R27.2 R155.1 Tr1.7 Tr1.8 U3.4(GND)
P3V3: C26.1 C27.1 C28.1 IC3.2(OUT)
P5V0: C20.1 C24.1 C25.1 IC3.3(IN) L4.2
P12V0: C15.1 C22.1 D1.K D3.K D13.K R31.1 R34.1 R42.1 U3.6(VCC)
P12V_IN: D1.A D9.K F3.2
VSSA: C50.2 C54.2 C55.2 C268.2 IC34.4(E) IC35.15(VSSA)
NetC5_1: C5.1 D20.K L2.1 R111.2
NetC12_1: C12.1 C19.1 L4.1 L5.2 R20.2 R31.2
NetC13_2: C13.2 IC35.11(SP1) L3.2
NetC14_1: C14.1 IC35.10(SP2) L3.3
NetC21_1: C21.1 J1.2 L6.1
NetC21_2: C21.2 J1.1 L6.4
NetC23_1: C23.1 F3.1 L6.3
NetC30_2: C30.2 C111.2 U3.3(Ct)
NetC36_1: C36.1 C47.1 C261.1 C264.1 C265.1 C269.1 D21.K IC35.2(SSFT) IC35.12(VPOSF) IC35.16(VPOSS) IC35.20(FB) R144.1 Tr1.2
NetC36_2: C36.2 C47.2 C261.2 C264.2 C265.2 IC35.7(HSO) IC35.17(VSS1) IC35.19(VSS2) LED9.K
NetC50_1: C50.1 C268.1 R138.1
NetC54_1: C54.1 IC35.3(VDD) R7.2 R128.2
NetC55_1: C55.1 IC35.4(ISOSSFT)
NetC106_1: C106.1 C260.1 D20.A Tr1.9 Tr1.10
NetC106_2: C106.2 C260.2 R111.1
NetC108_1: C108.1 R141.1
NetC108_2: C108.2 C110.1
NetC110_2: C110.2 IC5.1(REF) R139.1 R140.1 R142.2
NetC141_2: C141.2 IC35.14(CT1) L1.2
NetC143_1: C143.1 IC35.13(CT2) L1.3
NetC266_1: C266.1 R140.2
NetD4_A: D4.A D21.A
NetD4_K: D4.K IC35.18(SWO) Tr1.1
NetD8_K: D8.K L5.1 U3.2(QE)
NetIC5_2: IC5.2(I/O) IC34.2(K) R141.2
NetIC34_1: IC34.1(A) R6.2 R129.2
NetIC34_3: IC34.3(C) IC35.1(EROUT) R7.1 R128.1 R138.2
NetIC35_5: IC35.5(~{PLOSS}) R44.2
NetIC35_6: IC35.6(RDET) R144.2
NetIC35_8: IC35.8(RCL) R143.2
NetJ6_4: L3.4 ; port POE4
NetJ6_5: L3.1 ; port POE3
NetJ6_7: L1.4 ; port POE2
NetJ6_8: L1.1 ; port POE1
NetLED9_A: LED9.A R45.1
NetR20_1: R20.1 R27.1 U3.5(FB)
NetR34_2: R34.2 R42.2 U3.1(QC) U3.7(Ipksens) U3.8(DRVcc)
NetR44_1: R44.1 R45.2
NetR142_1: R142.1 R155.2

### Notes on the sheet
- (near C5) C6
- C5
- (near C260) C7
- (near R111) R10
- (near R129) Designators from SI3402 datasheet
- (near R128) R11
- (near R6) R7
- (near C266) C8
- R12
- R8
- C9
- (near R139) R5= 88.7k
- R9
- C21
- R6=10.2k
- DC 12V
- (in symbol Tr_FAFA2925) Sec

### Library data of the parts
C5 C7 C56 = CAP_SMD_1206: Capacitor SMD; Supplier 1: Newark; Supplier Part Number 1: 90R7810
C12 C15 C20 C21 C23-C26 C28 C47 C261 C264 C265 C269 = CAP_SMD_0805: Capacitor SMD; Supplier 1: Farnell; Supplier Part Number 1: 1833812
C13 C14 C141 C143 = X7R,1000pF,2KV,1206_0: CAP,X7R,1000P,2KV,10%; Part number: 320001600G; Specification: 1206,ROHS; TYPE: CAPACITOR; Vivotek P/N: ?
C19 = CAP_ELECTRO_SMD_C: Electrolytic Capacitor
C22 = CAP_ELECTRO_SMD_D: Electrolytic Capacitor; Supplier 1: Farnell; Supplier Part Number 1: 1698664
C27 C55 C106 C260 C266 = CAP_SMD_0603: Capacitor SMD; Supplier 1: Digi-Key; Supplier Part Number 1: 490-1524-2-ND
C30 C111 = CAP_SMD: Capacitor SMD
C36 = CAP_ELECTRO_5mm: Electrolytic Capacitor; Supplier 1: Newark; Supplier Part Number 1: 55T0367
C50 C54 C108 C110 C268 = CAP_SMD_0402: Capacitor SMD; Supplier 1: Newark; Supplier Part Number 1: 14T3275
D1 D3 D8 D13 D20 = shottky_SS14_18: shottky diode (Maritex)
D4 D9 = D_TVS_33V_SMD_0.6KW_uni: transil 600W; Supplier 1: Farnell; Supplier Part Number 1: 1578879
D21 = D_ER1G: 1A, 400V, 35ns
F3 = F_PTC_9.5x6mm: 2.50A/15V; Supplier 1: Newark; Supplier Part Number 1: 61J7435
IC3 = REG_S1117-3.3D: Voltage Regulator
IC5 = REF_TLV431_SOT23_16V: 16V 1.24V ADJ Voltage reference; Supplier 1: Newark; Supplier Part Number 1: 31K7719
IC34 = OPTO-SFH6106-4: opto-coupler; Supplier 1: Newark; Supplier Part Number 1: 58K2193
IC35 = PM_Si3402: POE PD INTERFACE; Supplier 1: Digi-Key; Supplier Part Number 1: SI3402-A-GMR-ND
J1 = CON_TB2: Terminal Block
L1 L3 L6 = L_CMC_DLW5BT: CMC, 2A, 100R, 50V; Supplier 1: Digi-Key; Supplier Part Number 1: 490-4018-1-ND
L2 = L_POWER_DLCSN042C_1uH: 1uH, 2.9A, 0.07R, inductor (Maritex); Supplier 1: Newark; Supplier Part Number 1: 74R9551
L4 L5 = L_POWER_INDUCTOR_CSS075F: inductor
LED9 = LED_0603R: LED 0603 red; Supplier 1: Newark; Supplier Part Number 1: 22M3004
R6 R7 R128 R129 R141 = RES_0402: SMD Resistor; Supplier 1: Newark; Supplier Part Number 1: 59M6691
R20 R27 R31 = RES_SMD: SMD Resistor
R34 R42 R111 R138-R140 R142 R143 R155 = RES_0603: SMD Resistor; Supplier 1: Newark; Supplier Part Number 1: 39K0073
R44 R45 R144 = RES_0805: SMD Resistor; Supplier 1: Newark; Supplier Part Number 1: 05F1507
Tr1 = Tr_FAFA2925: 15W, 12V PoE Transformer, for Si3402, Coilcraft only; Supplier 1: Newark; Supplier Part Number 1: 13T9829
U3 = MC34063A

## Sheet MEAS_CPU.SchDoc
size A3
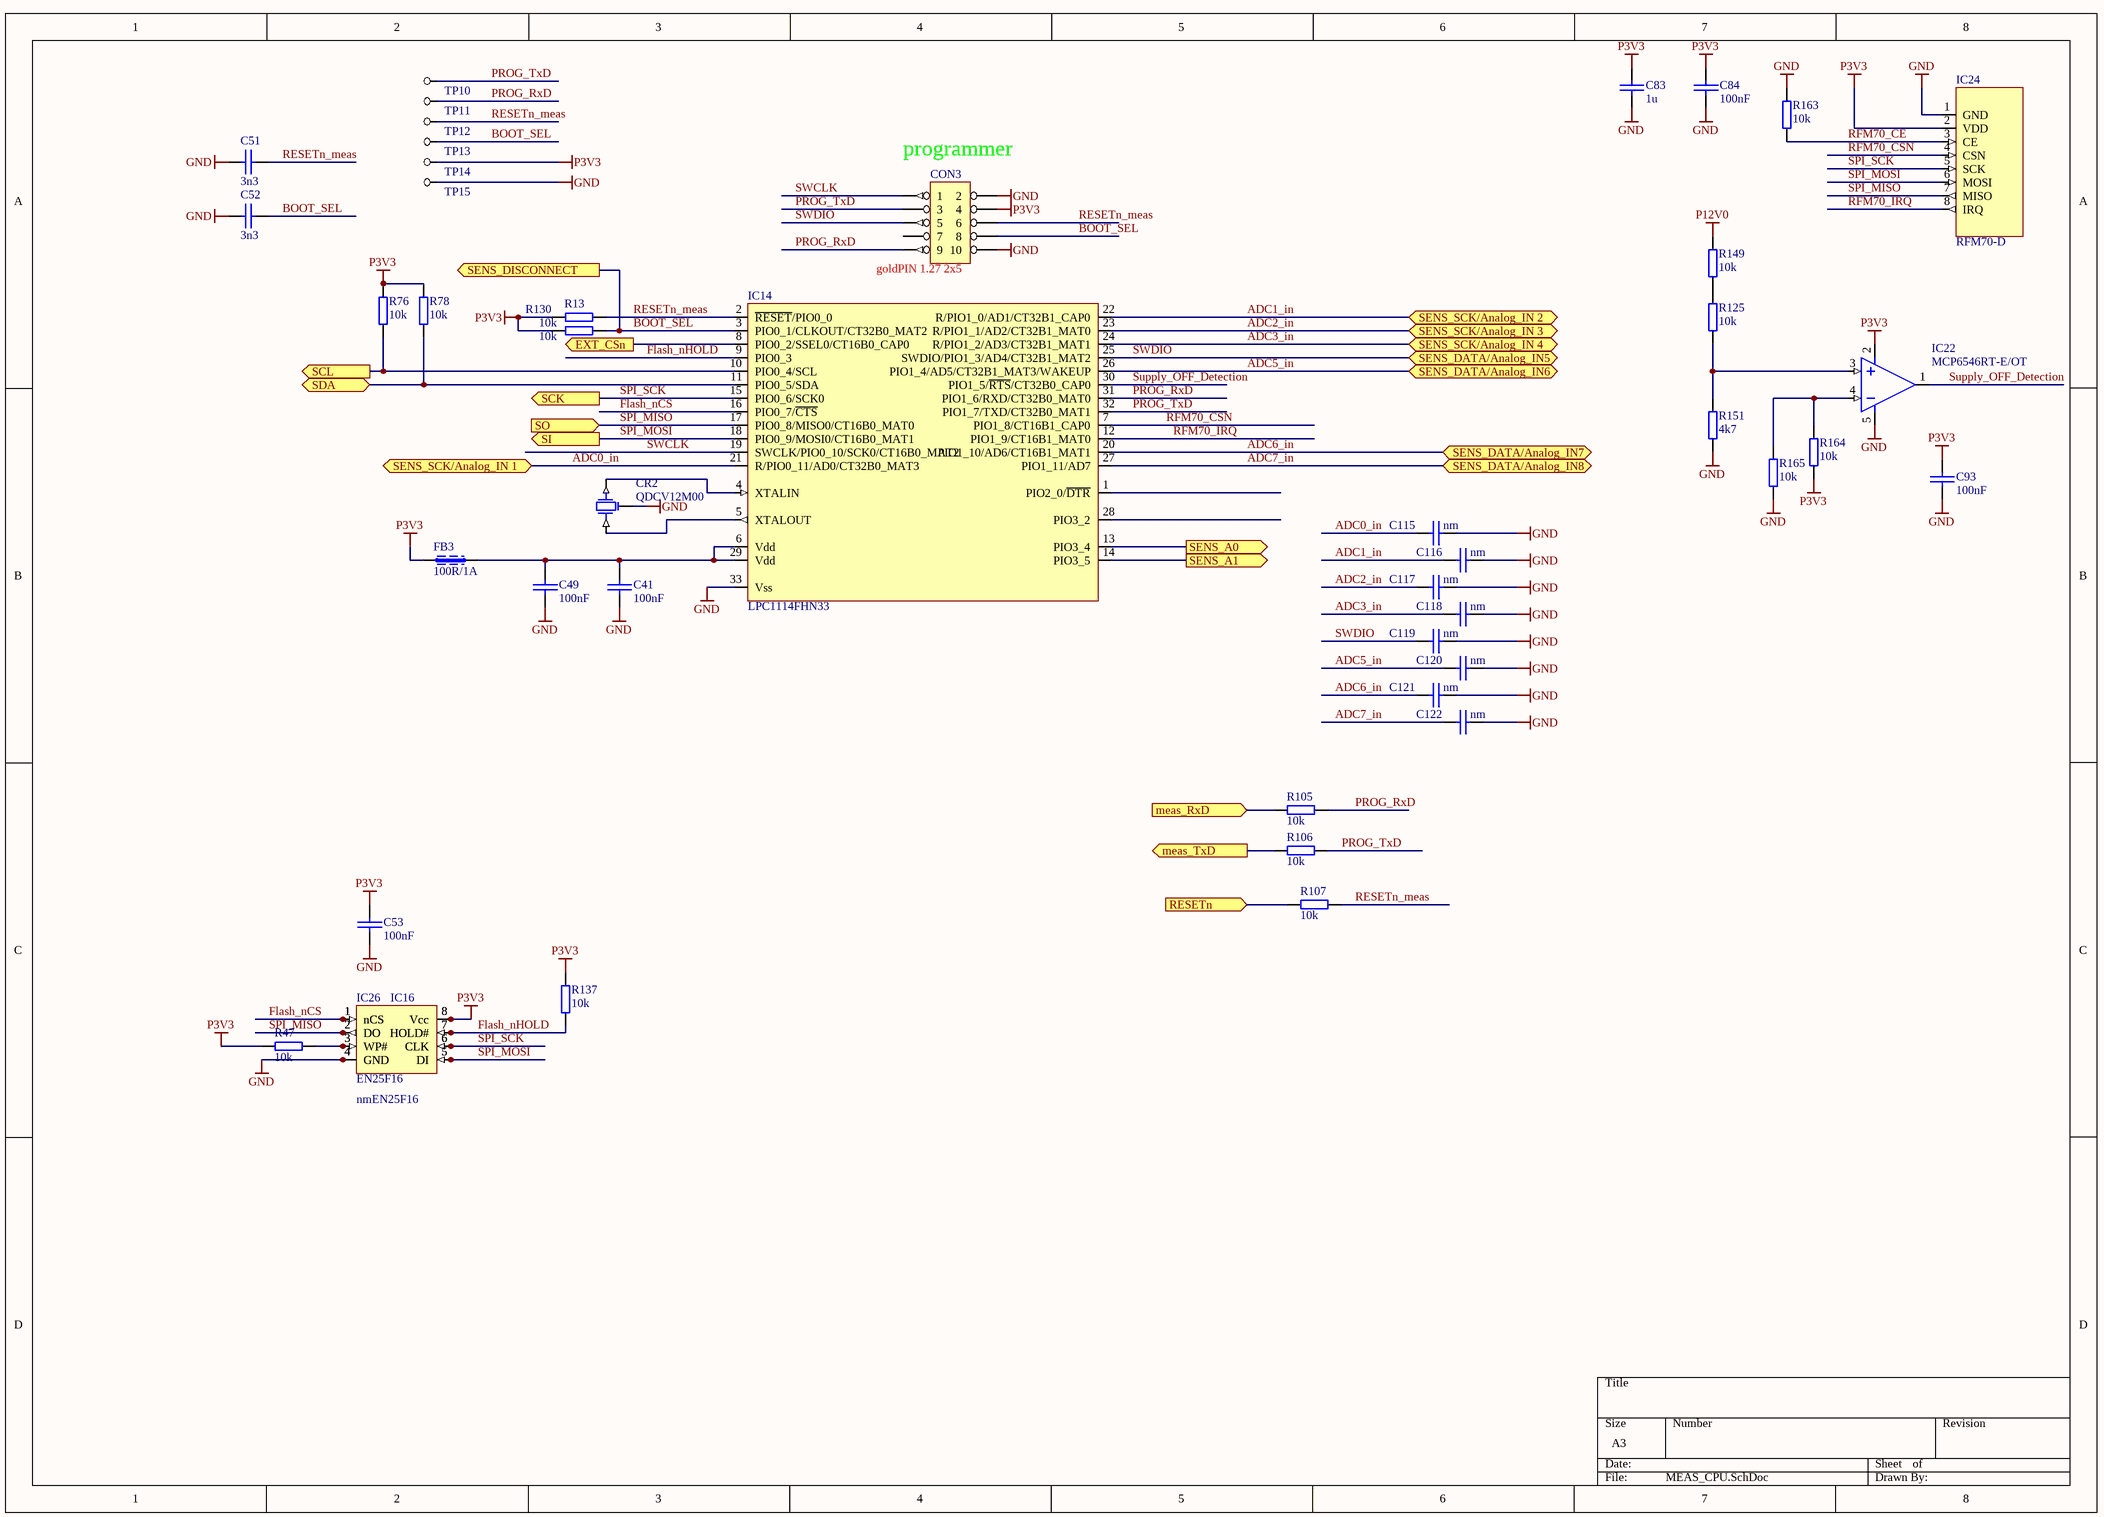
[diagram p4: MEAS_CPU.SchDoc]

### Parts
C41  100nF  [0402C]
C49  100nF  [0402C]
C51  3n3  [0603C]
C52  3n3  [0603C]
C53  100nF  [0402C]
C83  1u  [0603C]
C84  100nF  [0402C]
C93  100nF  [0402C]
C115  nm  [0402C]
C116  nm  [0402C]
C117  nm  [0402C]
C118  nm  [0402C]
C119  nm  [0402C]
C120  nm  [0402C]
C121  nm  [0402C]
C122  nm  [0402C]
CON3  goldPIN 1.27 2x5  [CON_2x5_MINI]
CR2  QDCV12M00  [CERAMIC_RES_QDCV]
FB3  100R/1A  [0603L]
IC14  LPC1114FHN33  [HVQFN33_QFN127P600-8N]
IC16  EN25F16  [SO-8]
IC22  MCP6546RT-E/OT  [SOT23-5]
IC24  RFM70-D  [RFM70-D]
IC26  nmEN25F16  [SO-8L]
R13  10k  [0402R]
R47  10k  [0402R]
R76  10k  [0402R]
R78  10k  [0402R]
R105  10k  [0402R]
R106  10k  [0402R]
R107  10k  [0402R]
R125  10k  [0402R]
R130  10k  [0402R]
R137  10k  [0402R]
R149  10k  [0402R]
R151  4k7  [0402R]
R163  10k  [0402R]
R164  10k  [0402R]
R165  10k  [0402R]
TP10  TP_PROG_TxD  [TP_large]  (value not drawn)
TP11  TP_PROG_RxD  [TP_large]  (value not drawn)
TP12  TP_RESETn  [TP_large]  (value not drawn)
TP13  TP_BOOT_SEL  [TP_large]  (value not drawn)
TP14  TP_3V3_meas  [TP_large]  (value not drawn)
TP15  TP_GND_meas  [TP_large]  (value not drawn)

### Ports
EXT_CSn (out), meas_RxD (in), meas_TxD (out), RESETn (in), SCK (out), SCL (out), SDA (bidir), SENS_A0 (out), SENS_A1 (out), SENS_DATA/Analog_IN5 (bidir), SENS_DATA/Analog_IN6 (bidir), SENS_DATA/Analog_IN7 (bidir), SENS_DATA/Analog_IN8 (bidir), SENS_DISCONNECT (out), SENS_SCK/Analog_IN 1 (bidir), SENS_SCK/Analog_IN 2 (bidir), SENS_SCK/Analog_IN 3 (bidir), SENS_SCK/Analog_IN 4 (bidir), SI (out), SO (in)

### Nets
GND: C41.2 C49.2 C51.1 C52.1 C53.2 C83.2 C84.1 C93.1 C115.1 C116.1 C117.1 C118.1 C119.1 C120.1 C121.1 C122.1 CON3.2 CON3.10 CR2.2 IC14.33(Vss) IC16.4(GND) IC22.5 IC24.1(GND) IC26.4(GND) R151.1 R163.1 R165.1 TP15.1
P3V3: C53.1 C83.1 C84.2 C93.2 CON3.4 FB3.1 IC16.8(Vcc) IC22.2 IC24.2(VDD) IC26.8(Vcc) R13.1 R47.2 R76.2 R78.2 R130.1 R137.1 R164.1 TP14.1
P12V0: R149.2
ADC0_in: C115.2 IC14.21(R/PIO0_11/AD0/CT32B0_MAT3) ; port SENS_SCK/Analog_IN 1
ADC1_in: C116.2 IC14.22(R/PIO1_0/AD1/CT32B1_CAP0) ; port SENS_SCK/Analog_IN 2
ADC2_in: C117.2 IC14.23(R/PIO1_1/AD2/CT32B1_MAT0) ; port SENS_SCK/Analog_IN 3
ADC3_in: C118.2 IC14.24(R/PIO1_2/AD3/CT32B1_MAT1) ; port SENS_SCK/Analog_IN 4
ADC5_in: C120.2 IC14.26(PIO1_4/AD5/CT32B1_MAT3/WAKEUP) ; port SENS_DATA/Analog_IN6
ADC6_in: C121.2 IC14.20(PIO1_10/AD6/CT16B1_MAT1) ; port SENS_DATA/Analog_IN7
ADC7_in: C122.2 IC14.27(PIO1_11/AD7) ; port SENS_DATA/Analog_IN8
BOOT_SEL: C52.2 CON3.8 IC14.3(PIO0_1/CLKOUT/CT32B0_MAT2) R130.2 TP13.1 ; port SENS_DISCONNECT
Flash_nCS: IC14.16(PIO0_7/~{CTS}) IC16.1(nCS) IC26.1(nCS)
Flash_nHOLD: IC14.9(PIO0_3) IC16.7(HOLD#) IC26.7(HOLD#) R137.2
PROG_RxD: CON3.9 IC14.31(PIO1_6/RXD/CT32B0_MAT0) R105.2 TP11.1
PROG_TxD: CON3.3 IC14.32(PIO1_7/TXD/CT32B0_MAT1) R106.2 TP10.1
RESETn: R107.1 ; port RESETn
RESETn_meas: C51.2 CON3.6 IC14.2(~{RESET}/PIO0_0) R13.2 R107.2 TP12.1
RFM70_CE: IC24.3(CE) R163.2
RFM70_CSN: IC14.7(PIO1_8/CT16B1_CAP0) IC24.4(CSN)
RFM70_IRQ: IC14.12(PIO1_9/CT16B1_MAT0) IC24.8(IRQ)
RXD2: R106.1 ; port meas_TxD
SPI_MISO: IC14.17(PIO0_8/MISO0/CT16B0_MAT0) IC16.2(DO) IC24.7(MISO) IC26.2(DO) ; port SO
SPI_MOSI: IC14.18(PIO0_9/MOSI0/CT16B0_MAT1) IC16.5(DI) IC24.6(MOSI) IC26.5(DI) ; port SI
SPI_SCK: IC14.15(PIO0_6/SCK0) IC16.6(CLK) IC24.5(SCK) IC26.6(CLK) ; port SCK
Supply_OFF_Detection: IC14.30(PIO1_5/~{RTS}/CT32B0_CAP0) IC22.1
SWCLK: CON3.1 IC14.19(SWCLK/PIO0_10/SCK0/CT16B0_MAT2)
SWDIO: C119.2 CON3.5 IC14.25(SWDIO/PIO1_3/AD4/CT32B1_MAT2) ; port SENS_DATA/Analog_IN5
TXD2: R105.1 ; port meas_RxD
NetC41_1: C41.1 C49.1 FB3.2 IC14.6(Vdd) IC14.29(Vdd)
NetCR2_1: CR2.1 IC14.4(XTALIN)
NetCR2_3: CR2.3 IC14.5(XTALOUT)
NetIC6_3: IC14.11(PIO0_5/SDA) R78.1 ; port SDA
NetIC6_9: IC14.14(PIO3_5) ; port SENS_A1
NetIC6_10: IC14.13(PIO3_4) ; port SENS_A0
NetIC6_13: IC14.10(PIO0_4/SCL) R76.1 ; port SCL
NetIC8_13: IC14.8(PIO0_2/SSEL0/CT16B0_CAP0) ; port EXT_CSn
NetIC16_3: IC16.3(WP#) IC26.3(WP#) R47.1
NetIC22_3: IC22.3 R125.1 R151.2
NetIC22_4: IC22.4 R164.2 R165.2
NetR125_2: R125.2 R149.1

Not connected (* = marked no-connect by the designer): CON3 7; IC14 1(PIO2_0/~{DTR}) 28(PIO3_2)

### Notes on the sheet
- (near CON3) programmer

### Library data of the parts
C41 C49 C53 C84 C93 C115-C122 = CAP_SMD_0402: Capacitor SMD; Supplier 1: Newark; Supplier Part Number 1: 14T3275
C51 C52 C83 = CAP_SMD_0603: Capacitor SMD
CON3 = HEADER 5X2
CR2 = X_CERAMIC_RES: ceramic resonator QCC(QDCV)12.00 (Maritex)
FB3 = L_FERRITE_BEAD: ferrite bead
IC14 = UPC_LPC1111
IC16 IC26 = MEM_EN25F16: FLASH (maritex)
IC22 = CMP_MCP6546RT-E/OT: Open-Drain Output Sub-Microamp Comparators
IC24 = RFM70-D: Low Power High Performance 2.4 GHz GFSK Transceiver Module
R13 R47 R76 R78 R105-R107 R125 R130 R137 R149 R151 R163-R165 = RES_0402: SMD Resistor; Supplier 1: Newark; Supplier Part Number 1: 59M6691
TP10-TP15 = TP: Testpoint

## Sheet AC_SUPPLY.SchDoc
size A4
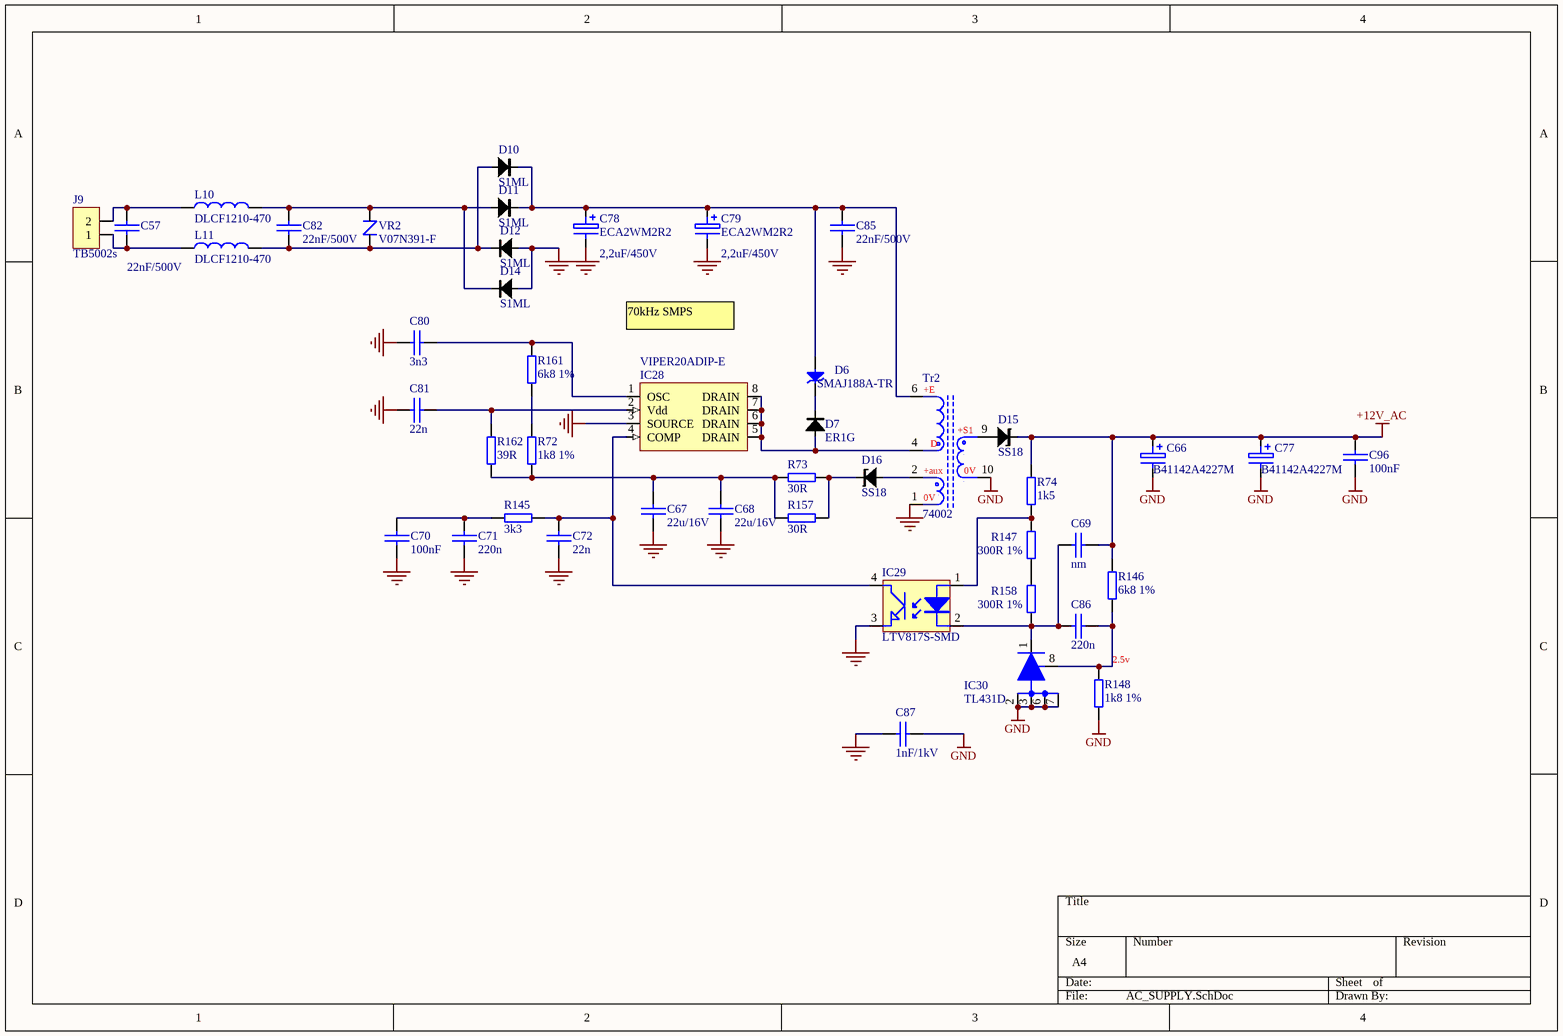
[diagram p5: AC_SUPPLY.SchDoc]

### Parts
C57  22nF/500V  [1206C]
C66  B41142A4227M  [CAP_SMT_EL_5mm_C]
C67  22u/16V  [1206C]
C68  22u/16V  [1206C]
C69  nm  [0402C]
C70  100nF  [0402C]
C71  220n  [0603C]
C72  22n  [0603C]
C77  B41142A4227M  [CAP_SMT_EL_5mm_C]
C78  ECA2WM2R2  value 2,2uF/450V  [RB.2/.4]
C79  ECA2WM2R2  value 2,2uF/450V  [RB.2/.4]
C80  3n3  [0603C]
C81  22n  [0603C]
C82  22nF/500V  [1206C]
C85  22nF/500V  [1206C]
C86  220n  [0603C]
C87  1nF/1kV  [1206C]
C96  100nF  [0402C]
D6  SMAJ188A-TR  [DO-214AA/SMB]
D7  ER1G  [DO-214AA/SMB]
D10  S1ML  [SOD-123]
D11  S1ML  [SOD-123]
D12  S1ML  [SOD-123]
D14  S1ML  [SOD-123]
D15  SS18  [DO-214AC/SMA]
D16  SS18  [DO-214AC/SMA]
IC28  VIPER20ADIP-E  [DIP-8]
IC29  LTV817S-SMD  [SOP_4]
IC30  TL431D  [SO-8]
J9  TB5002s  [tb5002s]
L10  DLCF1210-470  [DLCF1210]
L11  DLCF1210-470  [DLCF1210]
R72  1k8 1%  [0603R]
R73  30R  [0603R]
R74  1k5  [0805R]
R145  3k3  [0603R]
R146  6k8 1%  [0603R]
R147  300R 1%  [0603R]
R148  1k8 1%  [0603R]
R157  30R  [0603R]
R158  300R 1%  [0603R]
R161  6k8 1%  [0603R]
R162  39R  [0805R]
Tr2  74002  [Tr_74002_MYRRA]
VR2  V07N391-F  [Varistor_V07]

### Nets
+12V_AC: C66.1 C69.2 C77.1 C96.1 D15.K R74.1 R146.1
GND: C66.2 C77.2 C87.2 C96.2 IC30.2(A) IC30.3(A) IC30.6(K) IC30.7(A) R148.2 Tr2.10
HGND: C67.2 C68.2 C70.2 C71.2 C72.2 C78.2 C79.2 C80.1 C81.1 C85.1 C87.1 D12.A D14.A IC28.3(SOURCE) IC29.3(C) Tr2.1
NetC57_1: C57.1 J9.1 L11.1
NetC57_2: C57.2 J9.2 L10.1
NetC67_1: C67.1 C68.1 R72.1 R73.1 R157.1 R162.2
NetC69_1: C69.1 C86.1 IC29.2(K) IC30.1(I/O) R158.2
NetC70_1: C70.1 C71.1 R145.1
NetC72_1: C72.1 IC28.4(COMP) IC29.4(E) R145.2
NetC78_1: C78.1 C79.1 C85.2 D6.A D10.K D11.K Tr2.6
NetC80_2: C80.2 IC28.1(OSC) R161.1
NetC81_2: C81.2 IC28.2(Vdd) R162.1
NetC82_1: C82.1 D10.A D12.K L11.2 VR2.2
NetC82_2: C82.2 D11.A D14.K L10.2 VR2.1
NetC86_2: C86.2 IC30.8(REF) R146.2 R148.1
NetD6_K: D6.K D7.K
NetD7_A: D7.A IC28.5(DRAIN) IC28.6(DRAIN) IC28.7(DRAIN) IC28.8(DRAIN) Tr2.4
NetD15_A: D15.A Tr2.9
NetD16_A: D16.A Tr2.2
NetD16_K: D16.K R73.2 R157.2
NetIC29_1: IC29.1(A) R74.2 R147.1
NetR72_2: R72.2 R161.2
NetR147_2: R147.2 R158.1

### Notes on the sheet
- 70kHz SMPS
- (near R148) 2.5v
- (in symbol Tr_74002) +E; +S1; D; +aux; 0V

### Library data of the parts
C57 C82 C85 C87 = CAP_SMD_1206: Capacitor SMD; Supplier 1: Newark; Supplier Part Number 1: 90R7810
C66 C77 = CAP_ELECTRO_SMD_C: Electrolytic Capacitor
C67 C68 = CAP_SMD_0805: Capacitor SMD
C69 C70 C96 = CAP_SMD_0402: Capacitor SMD; Supplier 1: Newark; Supplier Part Number 1: 14T3275
C71 C72 C80 C81 C86 = CAP_SMD_0603: Capacitor SMD
C78 C79 = CAP_ELECTRO_10mm: Electrolytic Capacitor
D6 = D_TVS_600W: TVS, 200V; Part Number: P6KE200A; Part Description: Uni-Directional Transient Voltage Suppressor Diode; Manufacturer: FAIRCHILD SEMICONDUCTOR; Power: 600W; Table: Diodes; Component Kind: Standard; Component Type: Standard; Device: SMAJ188A-TR; Footprint: DO-15; PackageDescription: DO-15, Diode, Axial, Body 7.62 x 3.56mm (LxDia. Max), Pin spacing 13.97mm; Voltage: 200V; Manufacturer Part Number: P6KE200A; Pin Count: 2; Case: DO-15; Mounted: Yes; Socket: No; SMD: No; ComponentHeight: 3.56mm; HelpURL: \\cern.ch\dfs\Applications\Altium\Datasheets\P6KE6V8A.pdf; Author: CERN DEM JMW; CreateDate: 2008-10-01; LatestRevisionDate: 2008-10-01
D7 = D_ER1G: 1A, 400V, 35ns
D10-D12 D14 = D_S1ML: 1A, 1000V, 1.8us
D15 D16 = D_shottky_SS14_18: shottky diode (Maritex)
IC28 = PWM_VIPER20: 20W SMPS PRIMARY I.C.
IC29 = OPTO-LTV817S: transoptor
IC30 = REF_TL431_SO8: Voltage reference
J9 = CON_TB2: Terminal Block
L10 L11 = L_CHOKE_1210: Inductor (maritex)
R72 R73 R145-R148 R157 R158 R161 = RES_0603: SMD Resistor
  R73 R157: Supplier 1: Newark; Supplier Part Number 1: 39K0073
R74 R162 = RES_0805: SMD Resistor
Tr2 = Tr_74002: 6W 12V flyback transformer (MYRRA)
VR2 = Varistor V07N: varistor 7mm (Maritex)

## Sheet GPRS.SchDoc
size A3
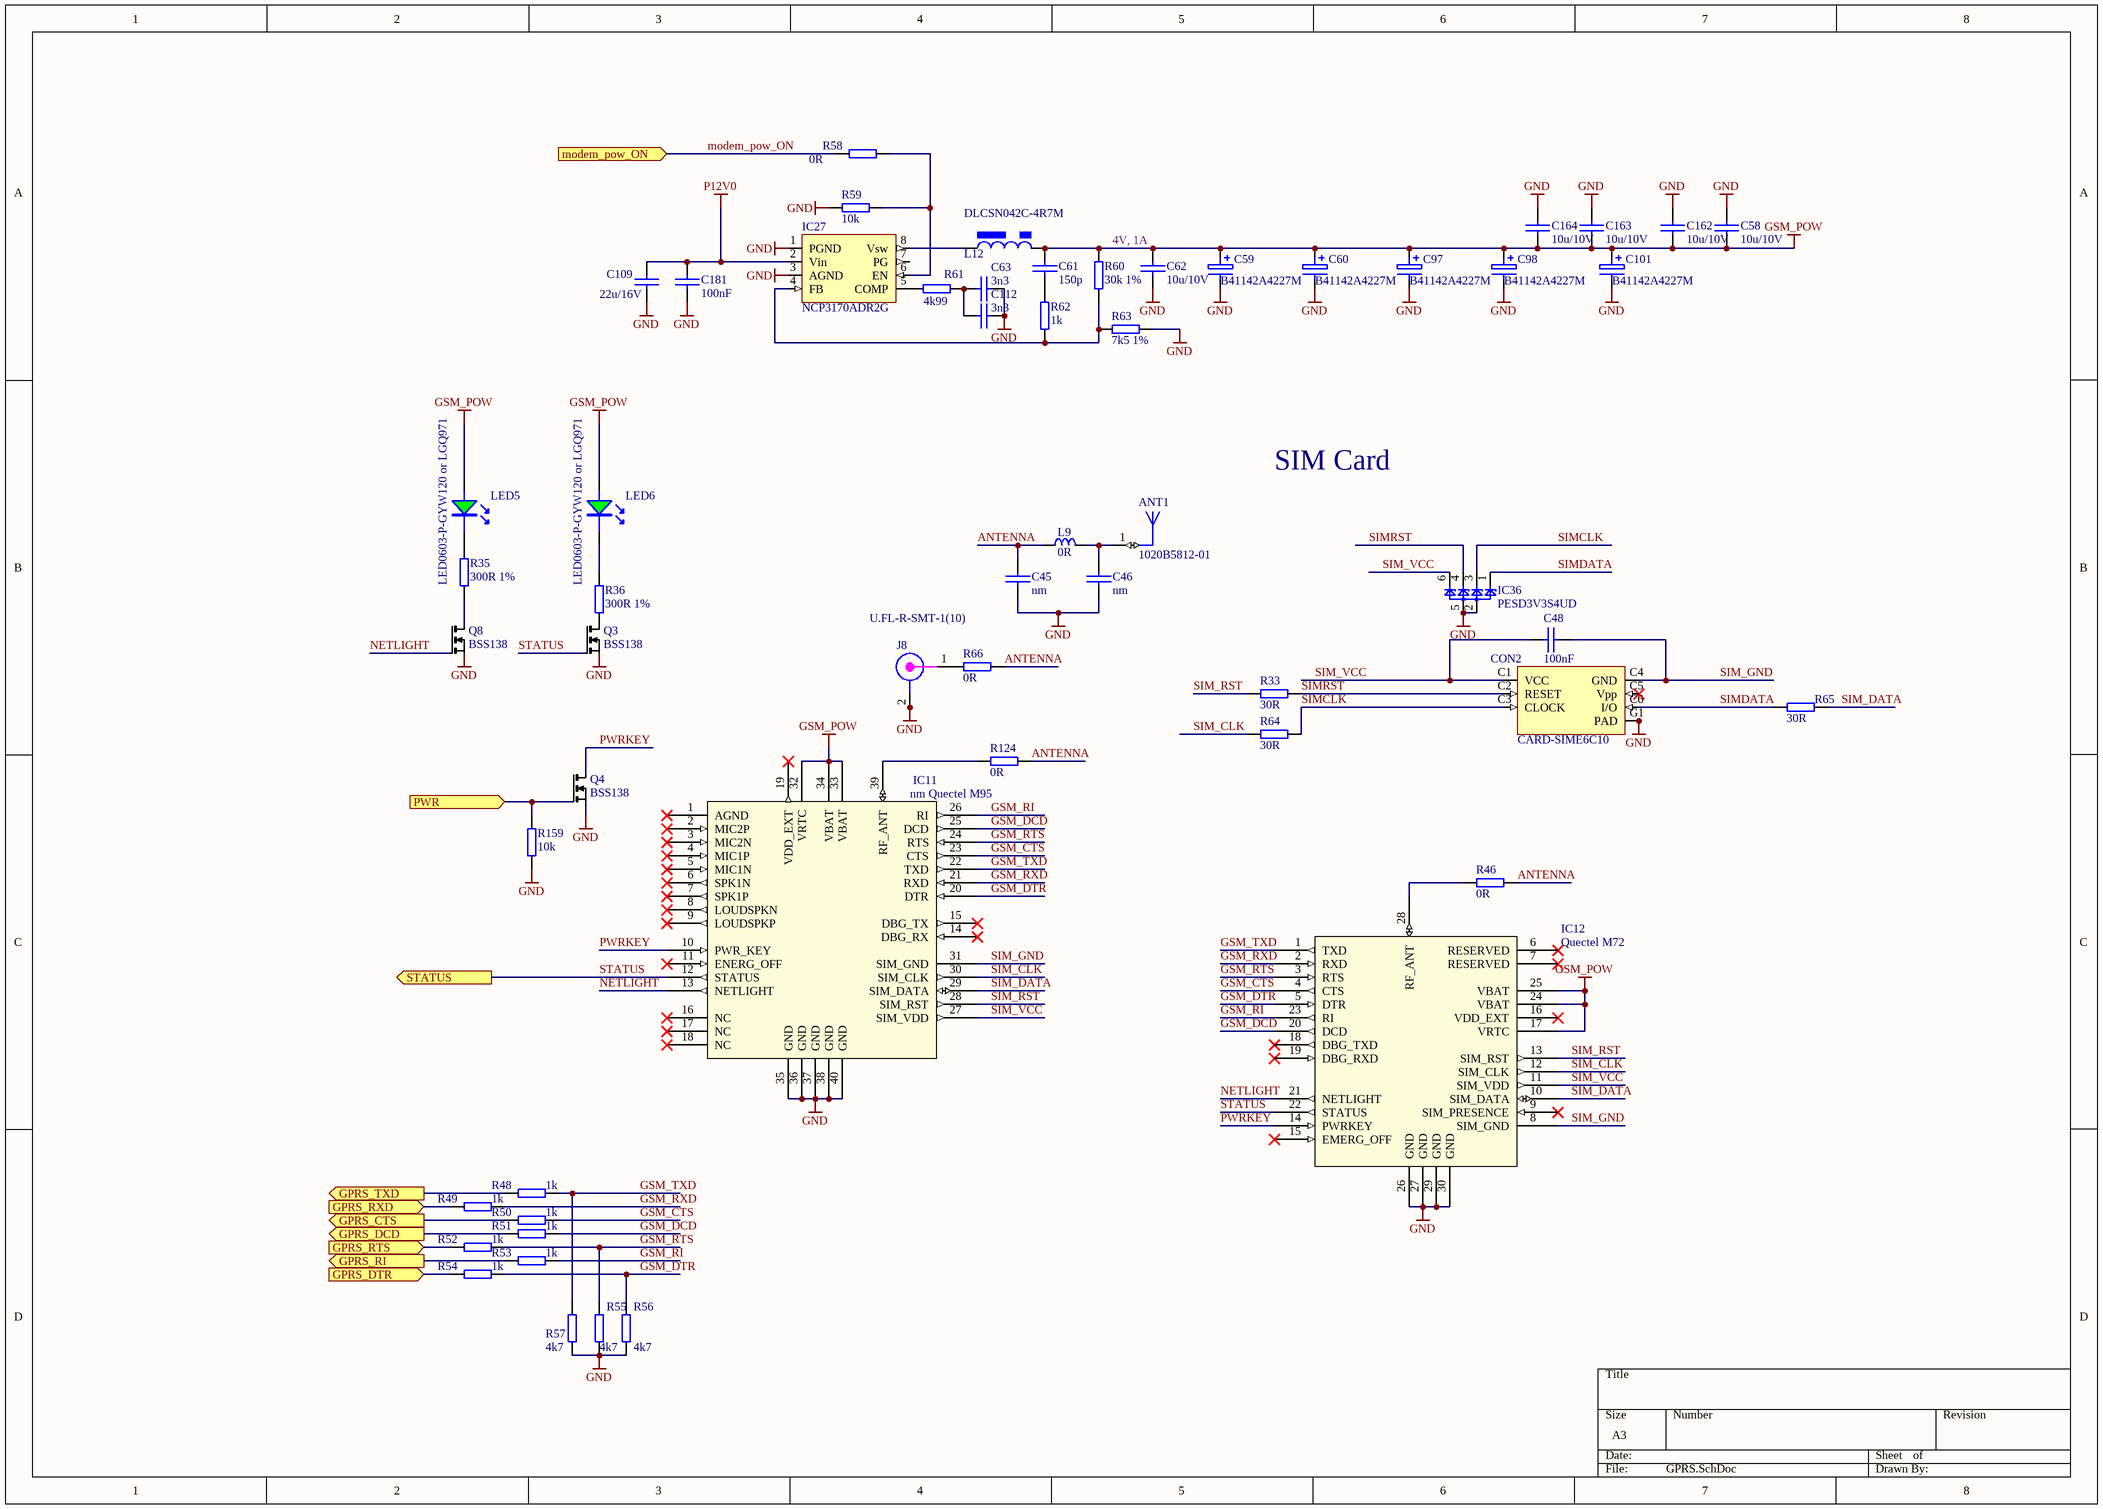
[diagram p6: GPRS.SchDoc]

### Parts
ANT1  1020B5812-01  [ANT27.3X7.9]
C45  nm  [0603C]
C46  nm  [0603C]
C48  100nF  [0402C]
C58  10u/10V  [0805C]
C59  B41142A4227M  [CAP_SMT_EL_5mm_C]
C60  B41142A4227M  [CAP_SMT_EL_5mm_C]
C61  150p  [0603C]
C62  10u/10V  [0805C]
C63  3n3  [0603C]
C97  B41142A4227M  [CAP_SMT_EL_5mm_C]
C98  B41142A4227M  [CAP_SMT_EL_5mm_C]
C101  B41142A4227M  [CAP_SMT_EL_5mm_C]
C109  22u/16V  [1206C]
C112  3n3  [0603C]
C162  10u/10V  [0805C]
C163  10u/10V  [0805C]
C164  10u/10V  [0805C]
C181  100nF  [0402C]
CON2  CARD-SIME6C10  [CON_CARD-SIME6C10]
IC11  nm Quectel M95  [QUECTEL M95]
IC12  Quectel M72  [Quectel M72 GSM Module]
IC27  NCP3170ADR2G  [so-8]
IC36  PESD3V3S4UD  [SOT457]
J8  U.FL-R-SMT-1(10)  [CON_UFL_HIROSE_RECEPTACLE]
L9  0R  [INDC1608X100N]
L12  DLCSN042C-4R7M  [L_DLCSN042C]
LED5  LED0603-P-GYW120 or LGQ971  [led_0603G]
LED6  LED0603-P-GYW120 or LGQ971  [led_0603G]
Q3  BSS138  [SOT-23]
Q4  BSS138  [SOT-23]
Q8  BSS138  [SOT-23]
R33  30R  [0603R]
R35  300R 1%  [0603R]
R36  300R 1%  [0603R]
R46  0R  [0603R]
R48  1k  [0402R]
R49  1k  [0402R]
R50  1k  [0402R]
R51  1k  [0402R]
R52  1k  [0402R]
R53  1k  [0402R]
R54  1k  [0402R]
R55  4k7  [0402R]
R56  4k7  [0402R]
R57  4k7  [0402R]
R58  0R  [0603R]
R59  10k  [0402R]
R60  30k 1%  [0603R]
R61  4k99  [0603R]
R62  1k  [0402R]
R63  7k5 1%  [0603R]
R64  30R  [0603R]
R65  30R  [0603R]
R66  0R  [0603R]
R124  0R  [0603R]
R159  10k  [0402R]

### Ports
GPRS_CTS (out), GPRS_DCD (out), GPRS_DTR (in), GPRS_RI (out), GPRS_RTS (in), GPRS_RXD (in), GPRS_TXD (out), modem_pow_ON (in), PWR (in), STATUS (out)

### Nets
GND: C45.2 C46.2 C58.1 C59.2 C60.2 C62.2 C63.2 C97.2 C98.2 C101.2 C109.2 C112.2 C162.1 C163.1 C164.1 C181.1 CON2.G1(PAD) CON2.G2(GND) CON2.G3(GND) CON2.G4(GND) IC11.35(GND) IC11.36(GND) IC11.37(GND) IC11.38(GND) IC11.40(GND) IC12.26(GND) IC12.27(GND) IC12.29(GND) IC12.30(GND) IC27.1(PGND) IC27.3(AGND) IC36.2 IC36.5 J8.2 J8.2a(GND) Q3.2(S) Q4.2(S) Q8.2(S) R55.1 R56.1 R57.1 R59.1 R63.1 R159.2
GSM_POW: C58.2 C59.1 C60.1 C61.1 C62.1 C97.1 C98.1 C101.1 C162.2 C163.2 C164.2 IC11.32(VRTC) IC11.33(VBAT) IC11.34(VBAT) IC12.17(VRTC) IC12.24(VBAT) IC12.25(VBAT) L12.2 LED5.A LED6.A R60.2
P12V0: C109.1 C181.2 IC27.2(Vin)
ANTENNA: C45.1 L9.1 R46.1 R66.1 R124.1
CTS1: R50.1 ; port GPRS_CTS
GSM_CTS: IC11.23(CTS) IC12.4(CTS) R50.2
GSM_DCD: IC11.25(DCD) IC12.20(DCD) R51.2
GSM_DTR: IC11.20(DTR) IC12.5(DTR) R54.2 R56.2
GSM_RI: IC11.26(RI) IC12.23(RI) R53.2
GSM_RTS: IC11.24(RTS) IC12.3(RTS) R52.2 R55.2
GSM_RXD: IC11.21(RXD) IC12.2(RXD) R49.2
GSM_TXD: IC11.22(TXD) IC12.1(TXD) R48.2 R57.2
modem_pow_ON: R58.1 ; port modem_pow_ON
NETLIGHT: IC11.13(NETLIGHT) IC12.21(NETLIGHT) Q8.1(G)
PWRKEY: IC11.10(PWR_KEY) IC12.14(PWRKEY) Q4.3(D)
RTS1: R52.1 ; port GPRS_RTS
SIM_CLK: IC11.30(SIM_CLK) IC12.12(SIM_CLK) R64.1
SIM_DATA: IC11.29(SIM_DATA) IC12.10(SIM_DATA) R65.1
SIM_GND: C48.2 CON2.C4(GND) IC11.31(SIM_GND) IC12.8(SIM_GND)
SIM_RST: IC11.28(SIM_RST) IC12.13(SIM_RST) R33.2
SIM_VCC: C48.1 CON2.C1(VCC) IC11.27(SIM_VDD) IC12.11(SIM_VDD) IC36.6
SIMCLK: CON2.C3(CLOCK) IC36.3 R64.2
SIMDATA: CON2.C6(I/O) IC36.1 R65.2
SIMRST: CON2.C2(RESET) IC36.4 R33.1
STATUS: IC11.12(STATUS) IC12.22(STATUS) Q3.1(G) ; port STATUS
NetANT1_1: ANT1.1(FEED) C46.1 L9.2
NetC61_2: C61.2 R62.1
NetC63_1: C63.1 C112.1 R61.1
NetIC1_47: R54.1 ; port GPRS_DTR
NetIC1_48: R51.1 ; port GPRS_DCD
NetIC1_49: Q4.1(G) R159.1 ; port PWR
NetIC1_69: R53.1 ; port GPRS_RI
NetIC11_39: IC11.39(RF_ANT) R124.2
NetIC12_28: IC12.28(RF_ANT) R46.2
NetIC27_4: IC27.4(FB) R60.1 R62.2 R63.2
NetIC27_5: IC27.5(COMP) R61.2
NetIC27_6: IC27.6(EN) R58.2 R59.2
NetIC27_8: IC27.8(Vsw) L12.1
NetIC40_2: R49.1 ; port GPRS_RXD
NetIC40_5: R48.1 ; port GPRS_TXD
NetJ8_1: J8.1 R66.2
NetLED5_K: LED5.K R35.2
NetLED6_K: LED6.K R36.2
NetQ3_3: Q3.3(D) R36.1
NetQ8_3: Q8.3(D) R35.1

Not connected (* = marked no-connect by the designer): CON2 C5(Vpp)*; IC11 1(AGND)* 2(MIC2P)* 3(MIC2N)* 4(MIC1P)* 5(MIC1N)* 6(SPK1N)* 7(SPK1P)* 8(LOUDSPKN)* 9(LOUDSPKP)* 11(ENERG_OFF)* 14(DBG_RX)* 15(DBG_TX)* 16(NC)* 17(NC)* 18(NC)* 19(VDD_EXT)*; IC12 6(RESERVED)* 7(RESERVED)* 9(SIM_PRESENCE)* 15(EMERG_OFF)* 16(VDD_EXT)* 18(DBG_TXD)* 19(DBG_RXD)*; IC27 7(PG)

### Notes on the sheet
- 4V, 1A
- SIM Card

### Library data of the parts
ANT1 = 1020B5812-01: Flavus GSM Snap-In Antenna, 800/900/1800/1900 MHz, 0.8mm PCB Thickness; PCB_Layout: Complies with manufacturer's recommendation.; Published: 30-May-2008; DatasheetVersion: AE030090-C; PackageVersion: Feb-2007; PackageReference: ANT27.3X7.9; Publisher: Altium Limited; PackageDescription: Snap-In Antenna, Plastic; Body 27.3 x 7.9 mm (LxW); ComponentLink1Description: Manufacturer Link; ComponentLink1URL: http://www.antenova.com/; ComponentLink2Description: Datasheet; ComponentLink2URL: http://www.antenova.com/?id=855&pv=1&lang=1
C45 C46 C61 C63 C112 = CAP_SMD_0603: Capacitor SMD
  C45 C46: Supplier 1: Digi-Key; Supplier Part Number 1: 490-1524-2-ND
C48 C181 = CAP_SMD_0402: Capacitor SMD; Supplier 1: Newark; Supplier Part Number 1: 14T3275
C58 C62 C162-C164 = CAP_SMD: Capacitor SMD
C59 C60 C97 C98 C101 = CAP_ELECTRO_SMD_C: Electrolytic Capacitor
C109 = CAP_SMD_1206: Capacitor SMD; Supplier 1: Newark; Supplier Part Number 1: 90R7810
CON2 = CON_CARD-SIME6C10: Sim Card Holder (Maritex)
IC11 = Quectel M95: GSM Module
IC12 = Quectel M72: GSM Module
IC27 = PWM_NCP3170: 4.5V to 18V, 3A synch buck
IC36 = D_TVS_PESD3V3S4UD: 3.3V TVS
J8 = CON_UFL_SMD: UFL; Supplier 1: Newark; Supplier Part Number 1: 50P8856
L9 = IND0603_WURTH_74279266: Inductor; Part Description: SMD EMI Suppression Chip Bead Ferrite (WE-CBF Serie); Manufacturer: WURTH ELEKTRONIK; Value: 1k@100MHz; Power: 200mA; Resistance: 0.6R; Tolerance: ±25%; Table: Inductors SMD; Part Number: IND0603_WURTH_74279266; Component Kind: Standard; Component Type: Standard; Pin Count: 2; Status: None; Manufacturer Part Number: 74279266; Case: 0603; Mounted: Yes; Socket: No; SMD: Yes; ComponentHeight: 1mm; HelpURL: \\cern.ch\dfs\Applications\Altium\Datasheets\IND0603_WURTH_74279266.pdf; Author: CERN DEM JLC; CreateDate: 2011-03-08; LatestRevisionDate: 2011-03-08
L12 = L_POWER_DLCSN042C: inductor (Maritex)
LED5 LED6 = LED_0603G: LED 0603 green; Supplier 1: Newark; Supplier Part Number 1: 05M0493
Q3 Q4 Q8 = Q_BSS138
R33 R46 R58 R59 R64-R66 R124 = RES_SMD: SMD Resistor
R35 R36 R60 R61 R63 = RES_0603: SMD Resistor
  R35 R36: Supplier 1: Newark; Supplier Part Number 1: 39K0073
R48-R57 R62 R159 = RES_0402: SMD Resistor; Supplier 1: Newark; Supplier Part Number 1: 59M6691

## Sheet RS422.SchDoc
size A4
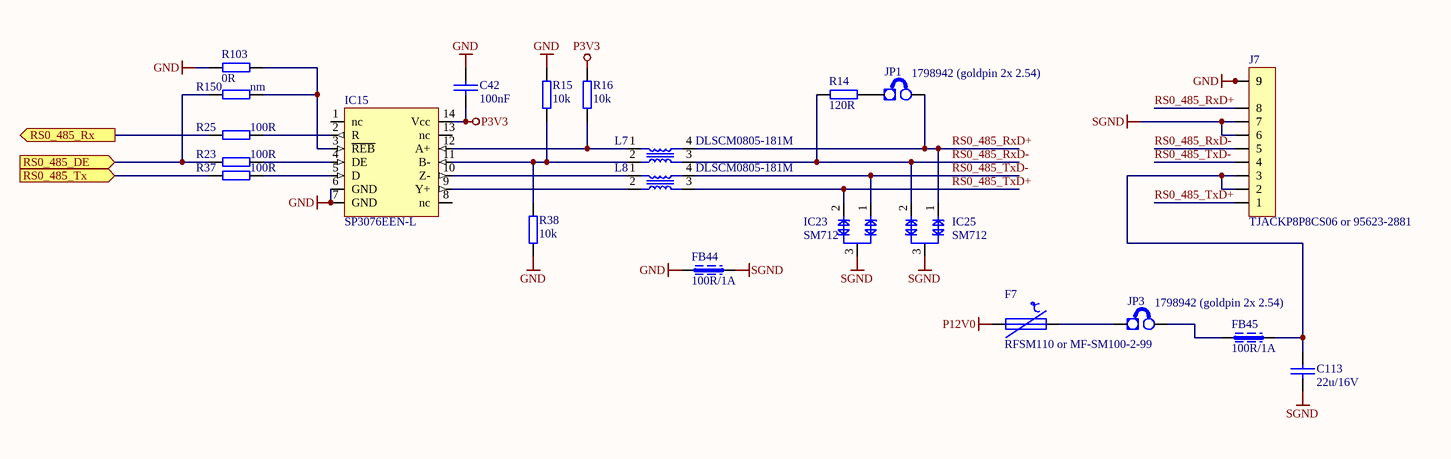
[diagram p7: RS422.SchDoc]

### Parts
C42  100nF  [0402C]
C113  22u/16V  [1206C]
F7  RFSM110 or MF-SM100-2-99  [SMD150-2]
FB44  100R/1A  [0603L]
FB45  100R/1A  [0603L]
IC15  SP3076EEN-L  [SO-14]
IC23  SM712  [SOT-23]
IC25  SM712  [SOT-23]
J7  TJACKP8P8CS06 or 95623-2881  [ETH_VERT_95623-2881]
JP1  1798942 (goldpin 2x 2.54)  [jump]
JP3  1798942 (goldpin 2x 2.54)  [jump]
L7  DLSCM0805-181M  [DLSCM0805]
L8  DLSCM0805-181M  [DLSCM0805]
R14  120R  [1206R]
R15  10k  [0402R]
R16  10k  [0402R]
R23  100R  [0402R]
R25  100R  [0402R]
R37  100R  [0402R]
R38  10k  [0402R]
R103  0R  [0603R]
R150  nm  [0402R]

### Ports
RS0_485_DE (in), RS0_485_Rx (out), RS0_485_Tx (in)

### Nets
GND: C42.1 FB44.1 IC15.6(GND) IC15.7(GND) J7.9a(9) J7.9b(9) R15.2 R38.1 R103.1
P3V3: C42.2 IC15.14(Vcc) R16.2
P12V0: F7.1
SGND: C113.2 FB44.2 IC23.3 IC25.3 J7.6 J7.7
RS0_485_DE: R23.1 R150.1 ; port RS0_485_DE
RS0_485_RxD+: IC25.1 J7.8 JP1.2(E2) L7.4
RS0_485_RxD-: IC25.2 J7.5 L7.3 R14.1
RS0_485_TxD+: IC23.2 J7.1 L8.3
RS0_485_TxD-: IC23.1 J7.4 L8.4
NetC113_1: C113.1 FB45.2 J7.2 J7.3
NetF7_2: F7.2 JP3.1(E1)
NetFB45_1: FB45.1 JP3.2(E2)
NetIC15_2: IC15.2(R) R25.2
NetIC15_3: IC15.3(~{REB}) R103.2 R150.2
NetIC15_4: IC15.4(DE) R23.2
NetIC15_5: IC15.5(D) R37.2
NetIC15_9: IC15.9(Y+) L8.2
NetIC15_10: IC15.10(Z-) L8.1
NetIC15_11: IC15.11(B-) L7.2 R15.1 R38.2
NetIC15_12: IC15.12(A+) L7.1 R16.1
NetIC40_1: R37.1 ; port RS0_485_Tx
NetIC40_3: R25.1 ; port RS0_485_Rx
NetJP1_1: JP1.1(E1) R14.2

Not connected (* = marked no-connect by the designer): IC15 1(nc) 8(nc) 13(nc)

### Library data of the parts
C42 = CAP_SMD_0402: Capacitor SMD; Supplier 1: Newark; Supplier Part Number 1: 14T3275
C113 = CAP_SMD_0805: Capacitor SMD
F7 = F_PTC_9.5x6mm: 2.50A/15V; Supplier 1: Newark; Supplier Part Number 1: 61J7435
FB44 FB45 = L_FERRITE_BEAD_0603: ferrite bead 100R@100MHz 1A; Supplier 1: Newark; Supplier Part Number 1: 89R3144
IC15 = DRV_SP3070/73/76: 3.3V, 1/8 Load, Failsafe  RS-485/RS422 Transceivers
IC23 IC25 = D_TVS_SM712: Asymmetrical TVS Diode for RS485
J7 = CON_MOD_8pin_V: Modular 8pin (Maritex or Molex)
JP1 JP3 = JUMPER: Supplier 1: Farnell; Supplier Part Number 1: 1798942
L7 L8 = L_CMC_DLSCM0805_180R: CMC 180R
R14 = RES_1206: SMD Resistor; Supplier 1: Newark; Supplier Part Number 1: 39K0871
R15 R16 R23 R25 R37 R38 R150 = RES_0402: SMD Resistor; Supplier 1: Newark; Supplier Part Number 1: 59M6691
R103 = RES_0603: SMD Resistor; Supplier 1: Newark; Supplier Part Number 1: 39K0073